# EAGLE board A33-OLinuXino_Rev_A (EAGLE 7.1.0)
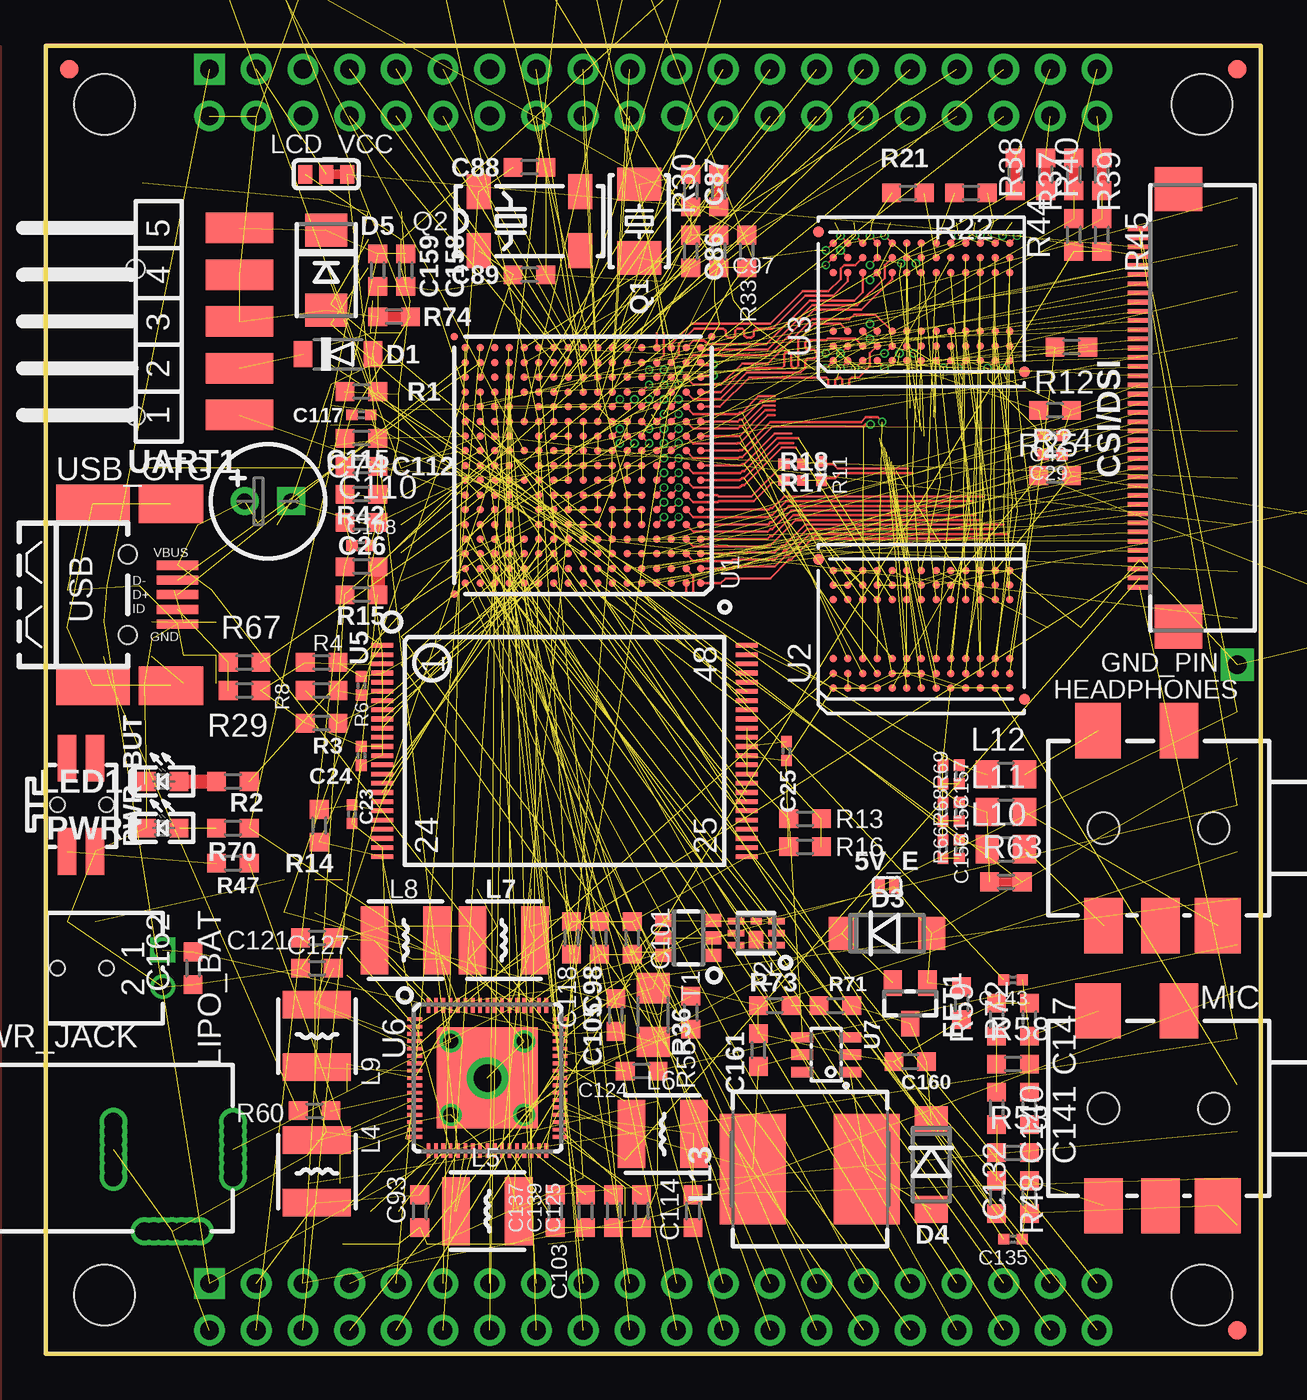
[diagram p5: board, top side]
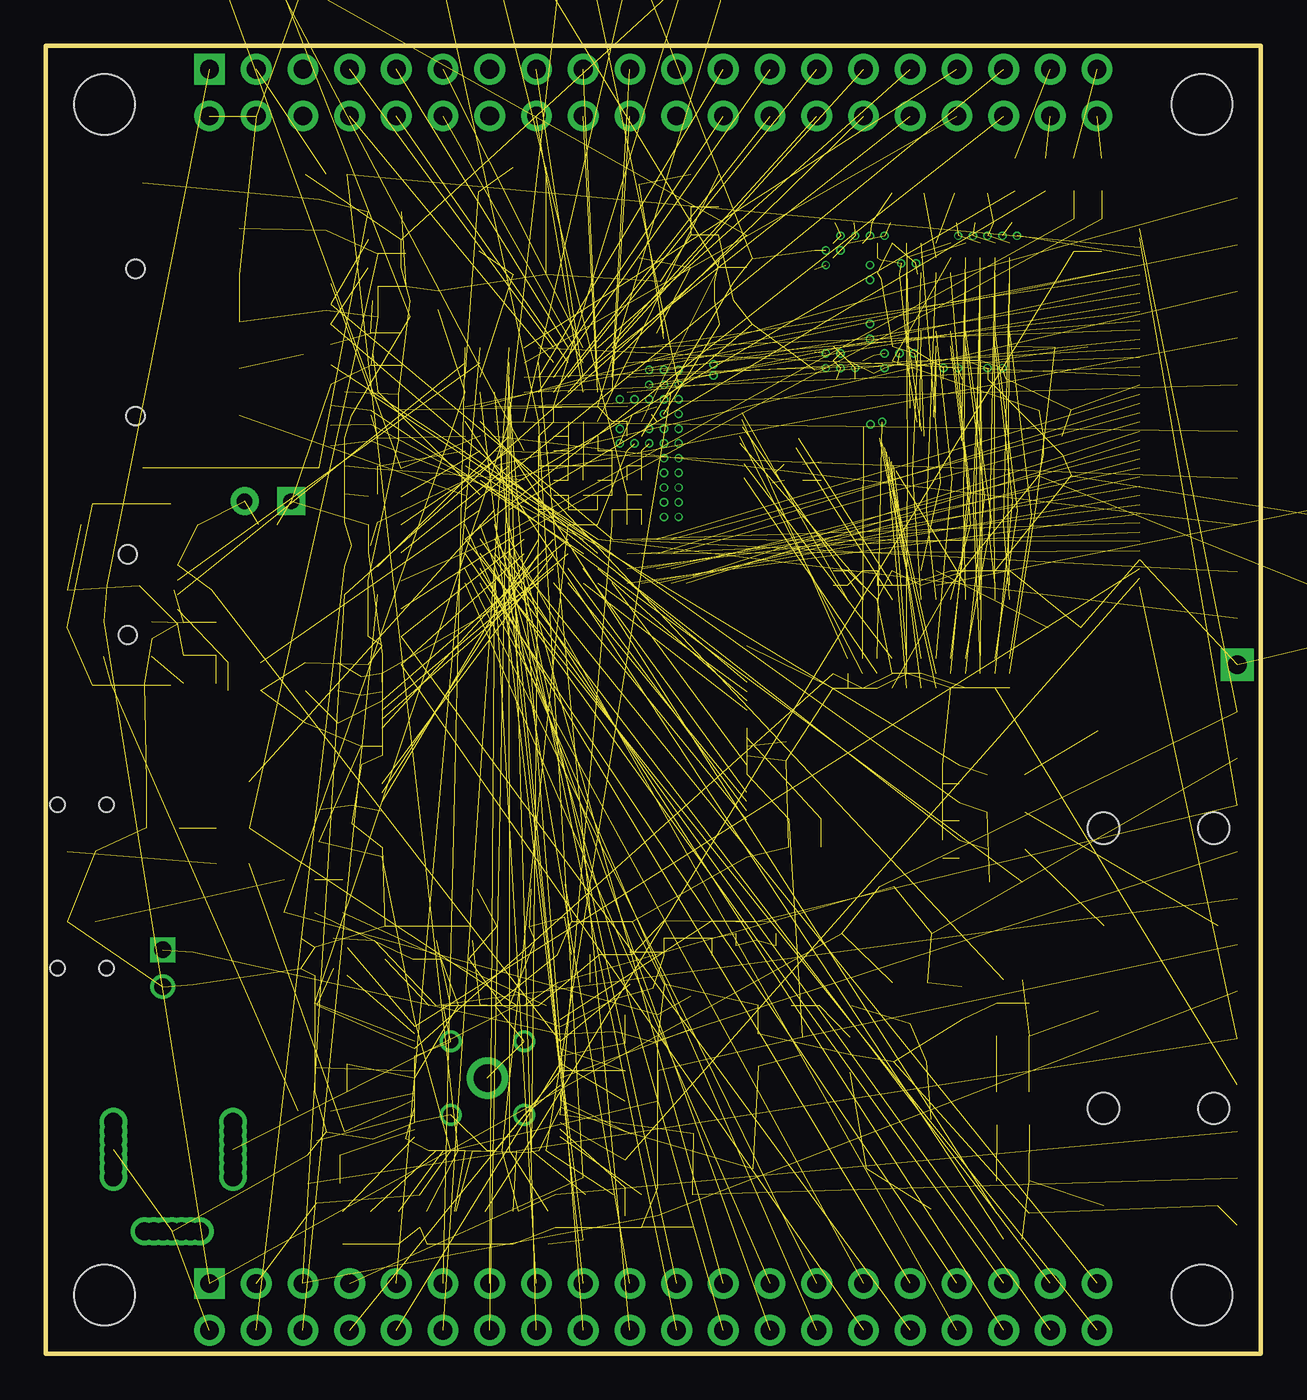
[diagram p6: board, inner layer GND]
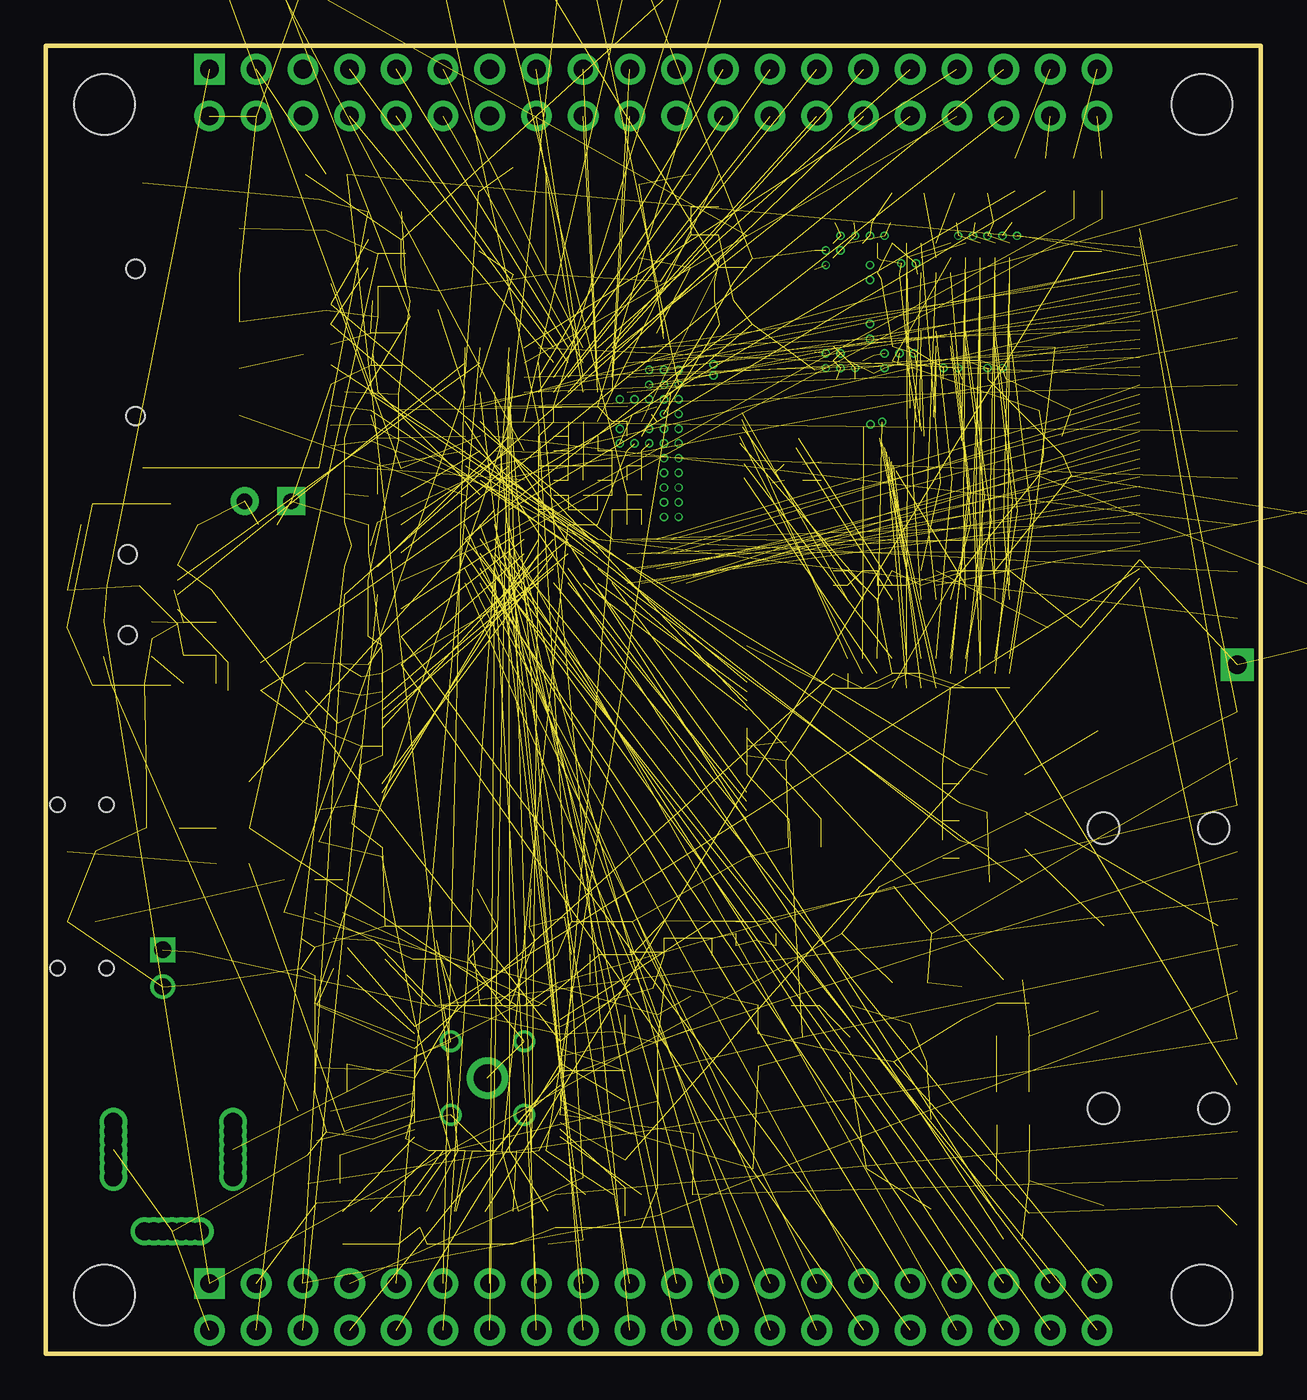
[diagram p7: board, inner layer Route3]
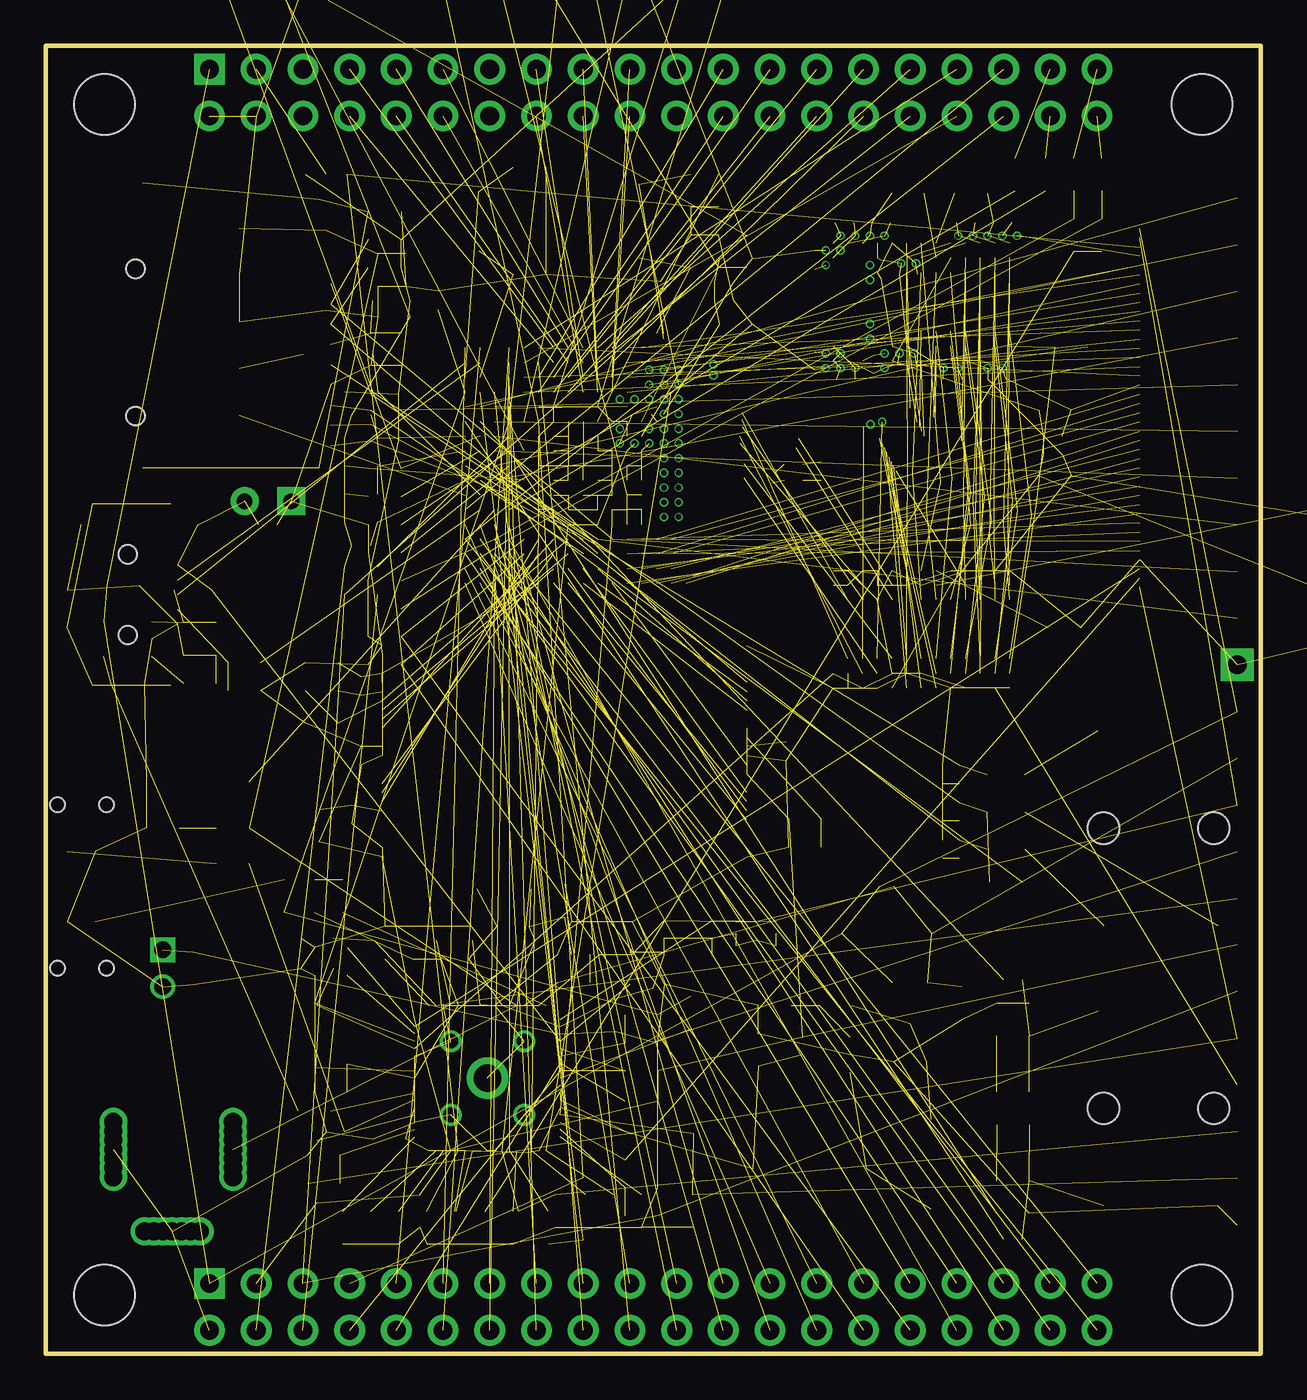
[diagram p8: board, inner layer Route14]
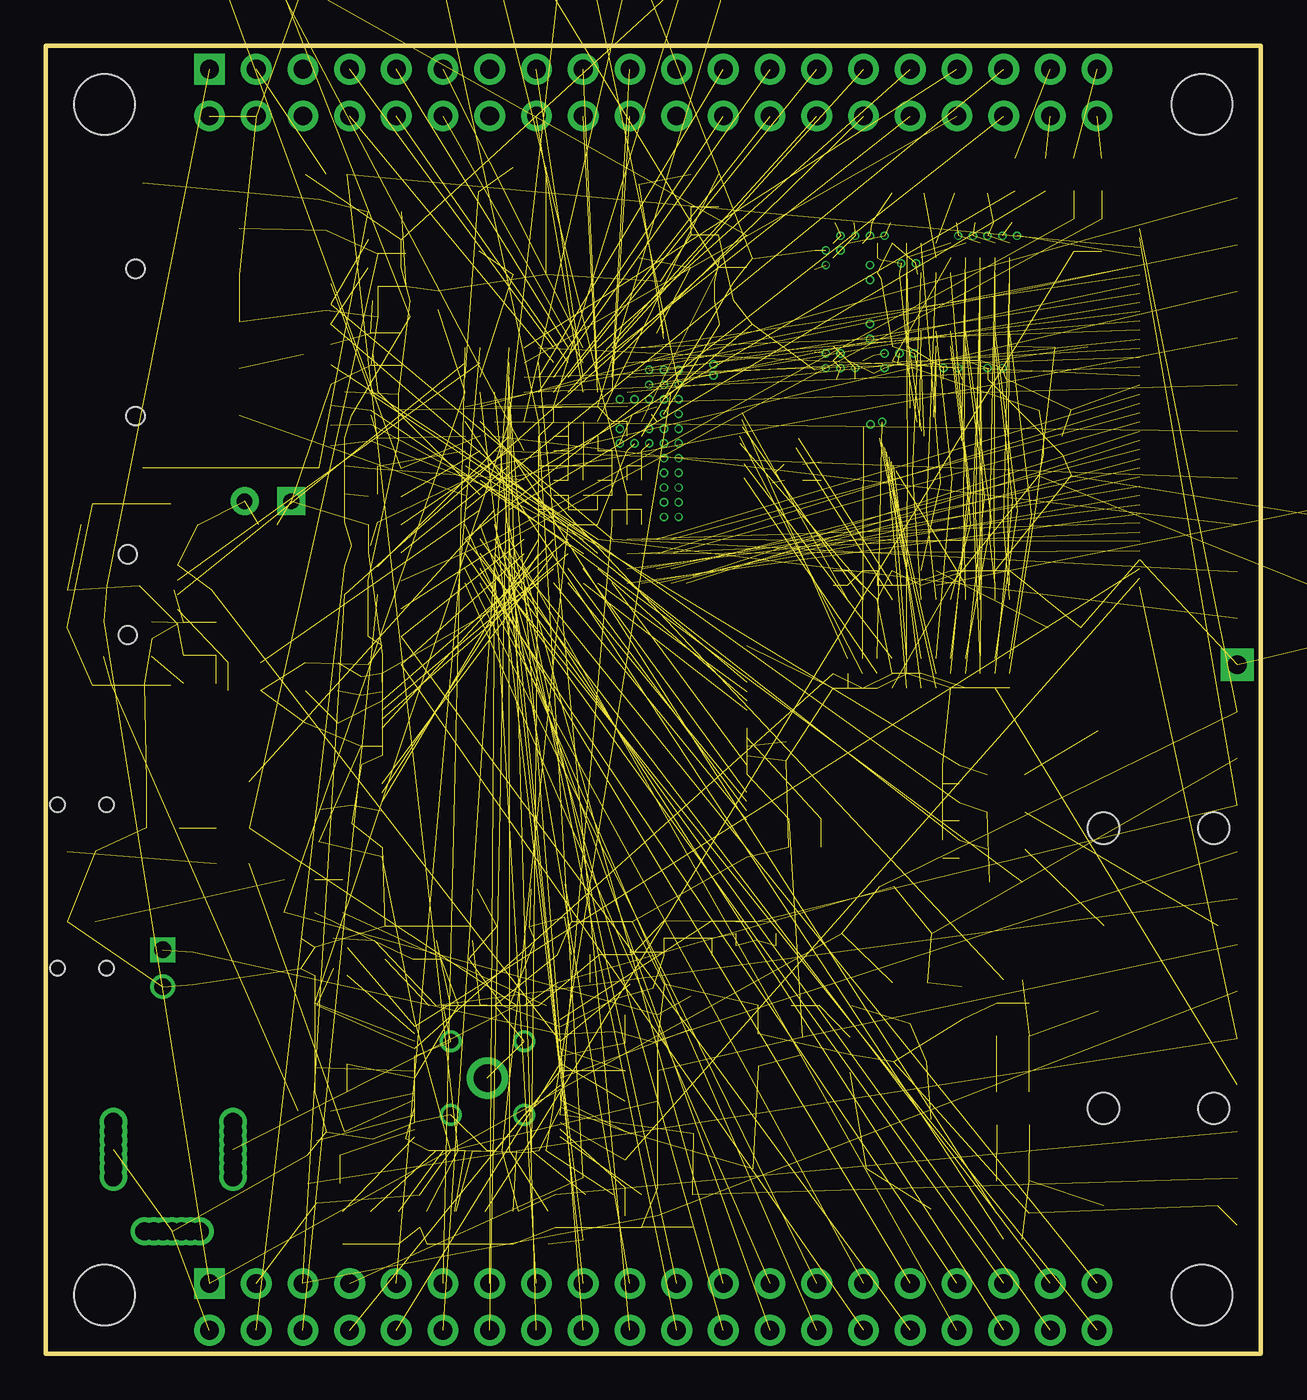
[diagram p9: board, inner layer PWR]
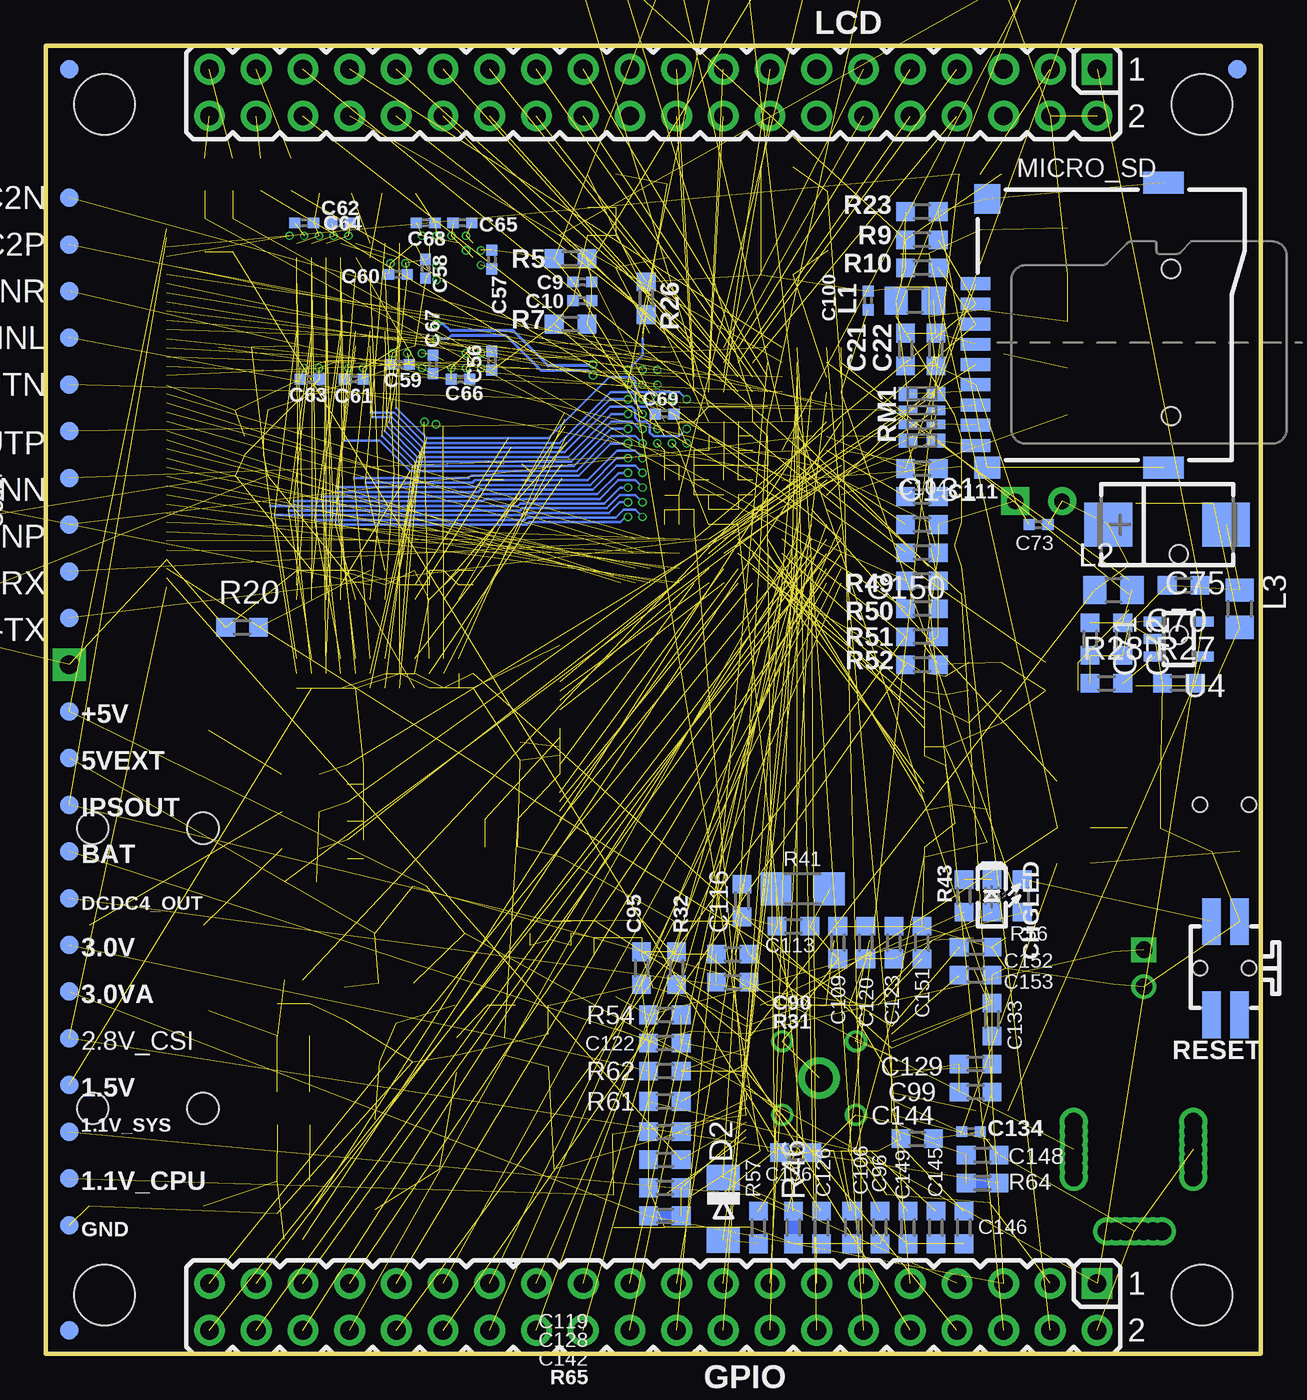
[diagram p10: board, bottom side, seen from below]

Size 66.04 x 71.12 mm. Coordinates in mm from the lower left corner, seen from the top.
Outline: 0,71.12 0,0 66.04,0 66.04,71.12 0,71.12
Copper layers (1+2*3+14*15+16): Top 0.035mm / dielectric 0.127mm / GND 0.035mm / dielectric 0.5mm / Route3 0.035mm / dielectric 0.2mm / Route14 0.035mm / dielectric 0.5mm / PWR 0.035mm / dielectric 0.127mm / Bottom 0.035mm
Design rules "default": minimum track width 4mil, minimum drill 0.2mm, track to track 5mil, track to pad 5mil, pad to pad 5mil, via to via 5mil, smd to smd 1mil, copper to edge 10mil, drill to drill 8mil, minimum pad ring 8mil, minimum via ring 3mil, stop-mask expansion 4mil, vias tented up to drill 28mil, thermal gap 20mil
Holes 3.3 mm at 3.17,67.94 62.87,67.94 3.17,3.17 62.87,3.17
tRestrict: area 0,64.8 to 6.3,71.1; area 59.7,64.8 to 66,71.1; area 0,0 to 6.3,6.3; area 59.7,0 to 66,6.3; 7 lines
bRestrict: area 0,64.8 to 6.3,71.1; area 59.7,64.8 to 66,71.1; area 0,0 to 6.3,6.3; area 59.7,0 to 66,6.3; 1 lines

## Footprints (pad centres in the part's own frame; a part is rotated, then mirrored left to right if it is on the bottom)
TESTPAD_40-ROUND = smd 1.016 x 1.016: 1 0,0
SJ_1_SMALLER = smd 0.508 x 0.762: 1 -0.381,0; 2 0.381,0
C0603_DWS = smd 1.016 x 1.016: 1 -0.889,0; 2 0.889,0
C0402_TI = smd 0.61 x 0.584: 1 -0.508,0; 2 0.508,0
E2,5-6,3 = drill 0.864 pad 1.524 round: + -1.27,0 | drill 0.864 pad 1.524 square: - 1.27,0
CT7343 = smd 2.6 x 2.4: + 3.2,0; - -3.2,0
LED-0603 = smd 1.016 x 1.016: A 0.889,0; C -0.889,0
FPV-WZA21-40-LF = smd 0.25 x 1.3: 1 -9.75,-2.75; 2 -9.25,-2.75; 3 -8.75,-2.75; 4 -8.25,-2.75; 5 -7.75,-2.75; 6 -7.25,-2.75; 7 -6.75,-2.75; 8 -6.25,-2.75; 9 -5.75,-2.75; 10 -5.25,-2.75; 11 -4.75,-2.75; 12 -4.25,-2.75; 13 -3.75,-2.75; 14 -3.25,-2.75; 15 -2.75,-2.75; 16 -2.25,-2.75; 17 -1.75,-2.75; 18 -1.25,-2.75; 19 -0.75,-2.75; 20 -0.25,-2.75; 21 0.25,-2.75; 22 0.75,-2.75; 23 1.25,-2.75; 24 1.75,-2.75; 25 2.25,-2.75; 26 2.75,-2.75; 27 3.25,-2.75; 28 3.75,-2.75; 29 4.25,-2.75; 30 4.75,-2.75; 31 5.25,-2.75; 32 5.75,-2.75; 33 6.25,-2.75; 34 6.75,-2.75; 35 7.25,-2.75; 36 7.75,-2.75; 37 8.25,-2.75; 38 8.75,-2.75; 39 9.25,-2.75; 40 9.75,-2.75 | smd 2.4 x 2.6: P1 -11.9,-0.65; P2 11.9,-0.65
SOD-123 = smd 1 x 1.4: A 1.9,0; C -1.9,0
MINI-MELF = smd 1.4 x 1.8: A 1.7,0; C -1.7,0
MLL-41 = smd 1.45 x 1.8: A 2.445,0; K -2.445,0
DO214AA = smd 1.778 x 2.286: A 2.177,0; C -2.177,0
SOT23 = smd 1.4 x 1: 1 1.1,-0.95; 2 1.1,0.95; 3 -1.1,0
TEST_PAD40/70/SQUARE = drill 1.016 pad 1.778 square: P$1 0,0
HN2X20-MALE = drill 1.016 pad 1.676 square: 1 -24.13,-1.27 | drill 1.016 pad 1.676 round: 2 -24.13,1.27; 3 -21.59,-1.27; 4 -21.59,1.27; 5 -19.05,-1.27; 6 -19.05,1.27; 7 -16.51,-1.27; 8 -16.51,1.27; 9 -13.97,-1.27; 10 -13.97,1.27; 11 -11.43,-1.27; 12 -11.43,1.27; 13 -8.89,-1.27; 14 -8.89,1.27; 15 -6.35,-1.27; 16 -6.35,1.27; 17 -3.81,-1.27; 18 -3.81,1.27; 19 -1.27,-1.27; 20 -1.27,1.27; 21 1.27,-1.27; 22 1.27,1.27; 23 3.81,-1.27; 24 3.81,1.27; 25 6.35,-1.27; 26 6.35,1.27; 27 8.89,-1.27; 28 8.89,1.27; 29 11.43,-1.27; 30 11.43,1.27; 31 13.97,-1.27; 32 13.97,1.27; 33 16.51,-1.27; 34 16.51,1.27; 35 19.05,-1.27; 36 19.05,1.27; 37 21.59,-1.27; 38 21.59,1.27; 39 24.13,-1.27; 40 24.13,1.27
SCJ325P00XG0B02G = smd 2.5 x 3: 1 6.3,-5.3; 2 -0.2,5.3 | smd 2.1 x 3: 3 6,5.3; 4 2.9,5.3; 5 1.9,-5.3 | hole 1.7: 0,0; 6,0
L0805_5MIL_DWS = smd 1.27 x 1.524: 1 -1.016,0; 2 1.016,0
SWPA4018S = smd 1.5 x 3.7: 1 -1.7,0; 2 1.7,0
8X8MM_3131 = smd 3.6 x 6: 1 -3.1,0; 2 3.1,0
SJ_2_SMALL_23_TIED = smd 0.762 x 1.016: 1 -1.143,0; 2 0,0; 3 1.143,0
DW02R = drill 0.9 square: 1 -1,0 | drill 0.9 round: 2 1,0
TFC-WPAPR-08 = smd 1.6 x 0.7: 1 -7.375,2.25; 2 -7.375,1.15; 3 -7.375,0.05; 4 -7.375,-1.05; 5 -7.375,-2.15; 6 -7.375,-3.25; 7 -7.375,-4.35; 8 -7.375,-5.45; 9 -7.375,-6.55 | smd 1.4 x 1.2: 10 -6.75,-7.75 | smd 1.4 x 1.6: 11 -6.75,6.85 | smd 2.2 x 1.2: 12 2.85,-7.75; 13 2.85,7.75 | hole 1: 3.25,-4.95; 3.25,3.05
SW_TAKT3X4 = smd 2.54 x 1.016: 1_1 -2.54,0.762; 1_2 2.54,0.762; 2_1 -2.54,-0.762; 2_2 2.54,-0.762 | hole 0.8: 0,-1.397; 0,1.27
PWR_JACK_UNI_MILLING = drill 1 round: + 0,4.75; +1 0,5.25; +2 0,5.75; +3 0,6.25; +4 0,4.25; +5 0,3.75; +6 0,3.25; - -6.5,4.75; -1 -6.5,5.25; -2 -6.5,5.75; -3 -6.5,4.25; -4 -6.5,3.75; -5 -6.5,6.25; -6 -6.5,3.25; -- -3.3,0.3; --1 -3.8,0.3; --2 -4.3,0.3; --3 -4.8,0.3; --4 -2.8,0.3; --5 -2.3,0.3; --6 -1.8,0.3
HCX-4S = smd 1.8 x 2.4: 1 -2,0; 2 2,0
MC-306 = smd 1.3 x 1.9: 1 -2.75,-1.6; 2 2.75,-1.6; 3 2.75,1.6; 4 -2.75,1.6
R0603_5MIL_DWS = smd 1.016 x 1.016: 1 -0.889,0; 2 0.889,0
R0402_TI = smd 0.61 x 0.584: 1 -0.508,0; 2 0.508,0
0603_0R = smd 1.016 x 1.016: 1 -0.889,0; 2 0.889,0
R1206_5MIL_WS = smd 1.651 x 1.778: 1 -1.46,0; 2 1.46,0
R_MATRIX_4 = smd 0.762 x 1.016: 1.1 -1.27,-0.762; 1.2 -1.27,0.762; 4.1 1.27,-0.762; 4.2 1.27,0.762 | smd 0.508 x 1.016: 2.1 -0.381,-0.762; 2.2 -0.381,0.762; 3.1 0.381,-0.762; 3.2 0.381,0.762
TSOT26 = smd 1 x 0.7: 1 1.3,-0.95; 2 1.3,0; 3 1.3,0.95; 4 -1.3,0.95; 5 -1.3,0; 6 -1.3,-0.95
DFN2*2-6L = smd 0.9 x 0.35: 1 1.1,-0.65; 2 1.1,0; 3 1.1,0.65; 4 -1.1,0.65; 5 -1.1,0; 6 -1.1,-0.65 | smd 0.8 x 0.95: 7 0,-0.35 | smd 0.6 x 0.35: 8 0,0.65
TFBGA282 = smd 0.4 x 0.4: A1 -6.4,-6.4; A2 -6.4,-5.6; A3 -6.4,-4.8; A4 -6.4,-4; A5 -6.4,-3.2; A6 -6.4,-2.4; A7 -6.4,-1.6; A8 -6.4,-0.8; A9 -6.4,0; A10 -6.4,0.8; A11 -6.4,1.6; A12 -6.4,2.4; A13 -6.4,3.2; A14 -6.4,4; A15 -6.4,4.8; A16 -6.4,5.6; A17 -6.4,6.4; B1 -5.6,-6.4; B2 -5.6,-5.6; B3 -5.6,-4.8; B4 -5.6,-4; B5 -5.6,-3.2; B6 -5.6,-2.4; B7 -5.6,-1.6; B8 -5.6,-0.8; B9 -5.6,0; B10 -5.6,0.8; B11 -5.6,1.6; B13 -5.6,3.2; B14 -5.6,4; B15 -5.6,4.8; B16 -5.6,5.6; B17 -5.6,6.4; C1 -4.8,-6.4; C2 -4.8,-5.6; C3 -4.8,-4.8; C4 -4.8,-4; C5 -4.8,-3.2; C6 -4.8,-2.4; C7 -4.8,-1.6; C8 -4.8,-0.8; C9 -4.8,0; C10 -4.8,0.8; C11 -4.8,1.6; C12 -4.8,2.4; C13 -4.8,3.2; C14 -4.8,4; C15 -4.8,4.8; C16 -4.8,5.6; C17 -4.8,6.4; D1 -4,-6.4; D2 -4,-5.6; D3 -4,-4.8; D4 -4,-4; D5 -4,-3.2; D6 -4,-2.4; D7 -4,-1.6; D8 -4,-0.8; D9 -4,0; D10 -4,0.8; D11 -4,1.6; D12 -4,2.4; D13 -4,3.2; D14 -4,4; D15 -4,4.8; D16 -4,5.6; D17 -4,6.4; E1 -3.2,-6.4; E2 -3.2,-5.6; E3 -3.2,-4.8; E4 -3.2,-4; E5 -3.2,-3.2; E6 -3.2,-2.4; E7 -3.2,-1.6; E8 -3.2,-0.8; E9 -3.2,0; E10 -3.2,0.8; E11 -3.2,1.6; E12 -3.2,2.4; E14 -3.2,4; E15 -3.2,4.8; E16 -3.2,5.6; E17 -3.2,6.4; F1 -2.4,-6.4; F2 -2.4,-5.6; F3 -2.4,-4.8; F4 -2.4,-4; F5 -2.4,-3.2; F6 -2.4,-2.4; F7 -2.4,-1.6; F8 -2.4,-0.8; F9 -2.4,0; F10 -2.4,0.8; F11 -2.4,1.6; F12 -2.4,2.4; F14 -2.4,4; F15 -2.4,4.8; F16 -2.4,5.6; F17 -2.4,6.4; FID1 7,-7; FID2 7,7; FID3 -7,7; G1 -1.6,-6.4; G2 -1.6,-5.6; G3 -1.6,-4.8; G4 -1.6,-4; G5 -1.6,-3.2; G6 -1.6,-2.4; G7 -1.6,-1.6; G8 -1.6,-0.8; G9 -1.6,0; G10 -1.6,0.8; G11 -1.6,1.6; G12 -1.6,2.4; G14 -1.6,4; G15 -1.6,4.8; G16 -1.6,5.6; G17 -1.6,6.4; H1 -0.8,-6.4; H2 -0.8,-5.6; H3 -0.8,-4.8; H4 -0.8,-4; H5 -0.8,-3.2; H6 -0.8,-2.4; H7 -0.8,-1.6; H8 -0.8,-0.8; H9 -0.8,0; H10 -0.8,0.8; H11 -0.8,1.6; H12 -0.8,2.4; H13 -0.8,3.2; H14 -0.8,4; H15 -0.8,4.8; H16 -0.8,5.6; H17 -0.8,6.4; J1 0,-6.4; J2 0,-5.6; J3 0,-4.8; J4 0,-4; J5 0,-3.2; J6 0,-2.4; J7 0,-1.6; J8 0,-0.8; J9 0,0; J10 0,0.8; J11 0,1.6; J12 0,2.4; J14 0,4; J15 0,4.8; J16 0,5.6; J17 0,6.4; K1 0.8,-6.4; K2 0.8,-5.6; K3 0.8,-4.8; K4 0.8,-4; K5 0.8,-3.2; K6 0.8,-2.4; K7 0.8,-1.6; K8 0.8,-0.8; K9 0.8,0; K10 0.8,0.8; K11 0.8,1.6; K12 0.8,2.4; K13 0.8,3.2; K14 0.8,4; K15 0.8,4.8; K16 0.8,5.6; K17 0.8,6.4; L1 1.6,-6.4; L2 1.6,-5.6; L3 1.6,-4.8; L4 1.6,-4; L5 1.6,-3.2; L6 1.6,-2.4; L7 1.6,-1.6; L8 1.6,-0.8; L9 1.6,0; L10 1.6,0.8; L11 1.6,1.6; L12 1.6,2.4; L14 1.6,4; L15 1.6,4.8; L16 1.6,5.6; L17 1.6,6.4; M1 2.4,-6.4; M2 2.4,-5.6; M3 2.4,-4.8; M4 2.4,-4; M5 2.4,-3.2; M6 2.4,-2.4; M7 2.4,-1.6; M8 2.4,-0.8; M9 2.4,0; M10 2.4,0.8; M11 2.4,1.6; M12 2.4,2.4; M13 2.4,3.2; M14 2.4,4; M15 2.4,4.8; M16 2.4,5.6; M17 2.4,6.4; N1 3.2,-6.4; N2 3.2,-5.6; N3 3.2,-4.8; N4 3.2,-4; N5 3.2,-3.2; N6 3.2,-2.4; N7 3.2,-1.6; N8 3.2,-0.8; N9 3.2,0; N10 3.2,0.8; N11 3.2,1.6; N12 3.2,2.4; N14 3.2,4; N15 3.2,4.8; N16 3.2,5.6; N17 3.2,6.4; P1 4,-6.4; P2 4,-5.6; P3 4,-4.8; P4 4,-4; P5 4,-3.2; P6 4,-2.4; P7 4,-1.6; P8 4,-0.8; P9 4,0; P10 4,0.8; P11 4,1.6; P12 4,2.4; P13 4,3.2; P14 4,4; P15 4,4.8; P16 4,5.6; P17 4,6.4; R1 4.8,-6.4; R2 4.8,-5.6; R3 4.8,-4.8; R4 4.8,-4; R5 4.8,-3.2; R6 4.8,-2.4; R7 4.8,-1.6; R8 4.8,-0.8; R9 4.8,0; R10 4.8,0.8; R11 4.8,1.6; R12 4.8,2.4; R13 4.8,3.2; R14 4.8,4; R15 4.8,4.8; R16 4.8,5.6; R17 4.8,6.4; T1 5.6,-6.4; T2 5.6,-5.6; T3 5.6,-4.8; T4 5.6,-4; T5 5.6,-3.2; T6 5.6,-2.4; T7 5.6,-1.6; T8 5.6,-0.8; T9 5.6,0; T10 5.6,0.8; T11 5.6,1.6; T12 5.6,2.4; T13 5.6,3.2; T14 5.6,4; T15 5.6,4.8; T16 5.6,5.6; T17 5.6,6.4; U1 6.4,-6.4; U2 6.4,-5.6; U3 6.4,-4.8; U4 6.4,-4; U5 6.4,-3.2; U6 6.4,-2.4; U7 6.4,-1.6; U8 6.4,-0.8; U9 6.4,0; U10 6.4,0.8; U11 6.4,1.6; U12 6.4,2.4; U13 6.4,3.2; U14 6.4,4; U15 6.4,4.8; U16 6.4,5.6; U17 6.4,6.4
FBGA78 = smd 0.4 x 0.4: A1 -4.8,-3.2; A2 -4.8,-2.4; A3 -4.8,-1.6; A7 -4.8,1.6; A8 -4.8,2.4; A9 -4.8,3.2; B1 -4,-3.2; B2 -4,-2.4; B3 -4,-1.6; B7 -4,1.6; B8 -4,2.4; B9 -4,3.2; C1 -3.2,-3.2; C2 -3.2,-2.4; C3 -3.2,-1.6; C7 -3.2,1.6; C8 -3.2,2.4; C9 -3.2,3.2; D1 -2.4,-3.2; D2 -2.4,-2.4; D3 -2.4,-1.6; D7 -2.4,1.6; D8 -2.4,2.4; D9 -2.4,3.2; E1 -1.6,-3.2; E2 -1.6,-2.4; E3 -1.6,-1.6; E7 -1.6,1.6; E8 -1.6,2.4; E9 -1.6,3.2; F1 -0.8,-3.2; F2 -0.8,-2.4; F3 -0.8,-1.6; F7 -0.8,1.6; F8 -0.8,2.4; F9 -0.8,3.2; G1 0,-3.2; G2 0,-2.4; G3 0,-1.6; G7 0,1.6; G8 0,2.4; G9 0,3.2; H1 0.8,-3.2; H2 0.8,-2.4; H3 0.8,-1.6; H7 0.8,1.6; H8 0.8,2.4; H9 0.8,3.2; J1 1.6,-3.2; J2 1.6,-2.4; J3 1.6,-1.6; J7 1.6,1.6; J8 1.6,2.4; J9 1.6,3.2; K1 2.4,-3.2; K2 2.4,-2.4; K3 2.4,-1.6; K7 2.4,1.6; K8 2.4,2.4; K9 2.4,3.2; L1 3.2,-3.2; L2 3.2,-2.4; L3 3.2,-1.6; L7 3.2,1.6; L8 3.2,2.4; L9 3.2,3.2; M1 4,-3.2; M2 4,-2.4; M3 4,-1.6; M7 4,1.6; M8 4,2.4; M9 4,3.2; N1 4.8,-3.2; N2 4.8,-2.4; N3 4.8,-1.6; N7 4.8,1.6; N8 4.8,2.4; N9 4.8,3.2 | smd 0.6 x 0.6: FID1 5.6,-3.8; FID2 -5.6,3.8
SOT23-5 = smd 1.2 x 0.55: 1 1.3,-0.95; 2 1.3,0; 3 1.3,0.95; 4 -1.3,0.95; 5 -1.3,-0.95
TSOP48 = smd 1.2 x 0.25: 1 -9.9,5.75; 2 -9.9,5.25; 3 -9.9,4.75; 4 -9.9,4.25; 5 -9.9,3.75; 6 -9.9,3.25; 7 -9.9,2.75; 8 -9.9,2.25; 9 -9.9,1.75; 10 -9.9,1.25; 11 -9.9,0.75; 12 -9.9,0.25; 13 -9.9,-0.25; 14 -9.9,-0.75; 15 -9.9,-1.25; 16 -9.9,-1.75; 17 -9.9,-2.25; 18 -9.9,-2.75; 19 -9.9,-3.25; 20 -9.9,-3.75; 21 -9.9,-4.25; 22 -9.9,-4.75; 23 -9.9,-5.25; 24 -9.9,-5.75; 25 9.9,-5.75; 26 9.9,-5.25; 27 9.9,-4.75; 28 9.9,-4.25; 29 9.9,-3.75; 30 9.9,-3.25; 31 9.9,-2.75; 32 9.9,-2.25; 33 9.9,-1.75; 34 9.9,-1.25; 35 9.9,-0.75; 36 9.9,-0.25; 37 9.9,0.25; 38 9.9,0.75; 39 9.9,1.25; 40 9.9,1.75; 41 9.9,2.25; 42 9.9,2.75; 43 9.9,3.25; 44 9.9,3.75; 45 9.9,4.25; 46 9.9,4.75; 47 9.9,5.25; 48 9.9,5.75
QFN68-8X8-04 = smd 0.2 x 0.8: 1 -3.2,-3.95; 2 -2.8,-3.95; 3 -2.4,-3.95; 4 -2,-3.95; 5 -1.6,-3.95; 6 -1.2,-3.95; 7 -0.8,-3.95; 8 -0.4,-3.95; 9 0,-3.95; 10 0.4,-3.95; 11 0.8,-3.95; 12 1.2,-3.95; 13 1.6,-3.95; 14 2,-3.95; 15 2.4,-3.95; 16 2.8,-3.95; 17 3.2,-3.95; 35 3.2,3.95; 36 2.8,3.95; 37 2.4,3.95; 38 2,3.95; 39 1.6,3.95; 40 1.2,3.95; 41 0.8,3.95; 42 0.4,3.95; 43 0,3.95; 44 -0.4,3.95; 45 -0.8,3.95; 46 -1.2,3.95; 47 -1.6,3.95; 48 -2,3.95; 49 -2.4,3.95; 50 -2.8,3.95; 51 -3.2,3.95 | smd 0.8 x 0.2: 18 3.95,-3.2; 19 3.95,-2.8; 20 3.95,-2.4; 21 3.95,-2; 22 3.95,-1.6; 23 3.95,-1.2; 24 3.95,-0.8; 25 3.95,-0.4; 26 3.95,0; 27 3.95,0.4; 28 3.95,0.8; 29 3.95,1.2; 30 3.95,1.6; 31 3.95,2; 32 3.95,2.4; 33 3.95,2.8; 34 3.95,3.2; 52 -3.95,3.2; 53 -3.95,2.8; 54 -3.95,2.4; 55 -3.95,2; 56 -3.95,1.6; 57 -3.95,1.2; 58 -3.95,0.8; 59 -3.95,0.4; 60 -3.95,0; 61 -3.95,-0.4; 62 -3.95,-0.8; 63 -3.95,-1.2; 64 -3.95,-1.6; 65 -3.95,-2; 66 -3.95,-2.4; 67 -3.95,-2.8; 68 -3.95,-3.2 | smd 5.49 x 5.49: GND 0,0 | drill 1.5 round: GND1 0,0 | drill 0.8 round: GND2 -2,-2; GND3 -2,2; GND4 2,2; GND5 2,-2
SOT23-6 = smd 1.2 x 0.55: 1 1.3,-0.95; 2 1.3,0; 3 1.3,0.95; 4 -1.3,0.95; 5 -1.3,0; 6 -1.3,-0.95
FIDUCIAL-1X3 = smd 1 x 1: 1 0,0
HR1X5-SMD = smd 1.651 x 3.683: 1 -5.08,-0.991; 2 -2.54,-0.991; 3 0,-0.991; 4 2.54,-0.991; 5 5.08,-0.991
USB_MINI_9PIN = smd 2.25 x 0.5: D+ 2.706,0; D- 2.706,0.8; GND 2.706,-1.6; ID 2.706,-0.8; VBUS 2.706,1.6 | smd 4 x 2.1: GND1 -1.9,4.95; GND3 -1.9,-4.95 | smd 3.5 x 2.1: GND2 2.35,4.95; GND4 2.35,-4.95 | hole 1: 0,2.2; 0,-2.2

## Placement (x,y rotation side)
1.1V_CPU  TESTPADTESTPAD_40-ROUND  [TESTPAD_40-ROUND]  64.77,9.53 0 bottom
1.1V_SYS  TESTPADTESTPAD_40-ROUND  [TESTPAD_40-ROUND]  64.77,12.06 270 bottom
1.5V  TESTPADTESTPAD_40-ROUND  [TESTPAD_40-ROUND]  64.77,14.61 90 bottom
2.8V_CSI  TESTPADTESTPAD_40-ROUND  [TESTPAD_40-ROUND]  64.77,17.14 0 bottom
3.0V  TESTPADTESTPAD_40-ROUND  [TESTPAD_40-ROUND]  64.77,22.23 270 bottom
3.0VA  TESTPADTESTPAD_40-ROUND  [TESTPAD_40-ROUND]  64.77,19.68 0 bottom
5V_E  Open  [SJ_1_SMALLER]  45.72,25.4 180 top
5VEXT  TESTPADTESTPAD_40-ROUND  [TESTPAD_40-ROUND]  64.77,32.38 270 bottom
+5V  TESTPADTESTPAD_40-ROUND  [TESTPAD_40-ROUND]  64.77,34.92 180 bottom
BAT  TESTPADTESTPAD_40-ROUND  [TESTPAD_40-ROUND]  64.77,27.3 90 bottom
C1  22uF/6.3V  [C0603_DWS]  29.37,81.79 270 bottom  (outside the outline)
C2  1uF  [C0603_DWS]  24.64,87.51 90 bottom  (outside the outline)
C3  100nF  [C0402_TI]  27.57,82.66 180 bottom  (outside the outline)
C4  100nF  [C0402_TI]  27.57,83.56 180 bottom  (outside the outline)
C5  100nF  [C0402_TI]  27.57,84.46 180 bottom  (outside the outline)
C6  100nF  [C0402_TI]  27.57,85.36 180 bottom  (outside the outline)
C7  100nF  [C0402_TI]  26.64,87.51 90 bottom  (outside the outline)
C8  100nF  [C0402_TI]  25.64,87.51 90 bottom  (outside the outline)
C9  100nF  [C0402_TI]  36.88,58.28 0 bottom
C10  100nF  [C0402_TI]  36.88,57.27 0 bottom
C11  22uF/6.3V  [C0603_DWS]  6.73,83.95 90 bottom  (outside the outline)
C12  1uF  [C0603_DWS]  5.21,83.95 90 bottom  (outside the outline)
C13  100nF  [C0402_TI]  19.59,81.36 180 bottom  (outside the outline)
C14  100nF  [C0402_TI]  19.59,80.16 180 bottom  (outside the outline)
C15  100nF  [C0402_TI]  21.72,80.66 0 bottom  (outside the outline)
C16  100nF  [C0402_TI]  23.67,80.66 0 bottom  (outside the outline)
C17  100nF  [C0402_TI]  23.67,81.96 0 bottom  (outside the outline)
C18  100nF  [C0402_TI]  20.45,83.69 270 bottom  (outside the outline)
C19  100nF  [C0402_TI]  22.48,83.69 270 bottom  (outside the outline)
C20  100nF  [C0402_TI]  21.46,83.69 270 bottom  (outside the outline)
C21  22uF/6.3V  [C0603_DWS]  19.3,54.61 90 bottom
C22  22uF/6.3V  [C0603_DWS]  17.65,54.61 90 bottom
C23  NA(100nF)  [C0402_TI]  16.64,29.34 90 top
C24  NA(100nF)  [C0402_TI]  17.14,32.51 90 top
C25  NA(100nF)  [C0402_TI]  40.26,32.77 90 top
C26  1nF  [C0603_DWS]  17.14,42.8 180 top
C27  100nF  [C0402_TI]  73.55,39.36 90 bottom  (outside the outline)
C28  100nF  [C0402_TI]  76.6,55.8 0 bottom  (outside the outline)
C29  100nF  [C0402_TI]  54.74,48.9 180 top
C30  22uF/6.3V  [C0603_DWS]  13.46,83.95 270 bottom  (outside the outline)
C31  1uF  [C0603_DWS]  11.94,83.95 270 bottom  (outside the outline)
C32  100nF  [C0402_TI]  27.89,86.86 270 bottom  (outside the outline)
C33  100nF  [C0402_TI]  16.64,76.71 90 top  (outside the outline)
C34  100nF  [C0402_TI]  15.62,76.71 90 top  (outside the outline)
C35  100nF  [C0402_TI]  14.61,76.71 90 top  (outside the outline)
C36  100nF  [C0402_TI]  14.73,83.31 90 bottom  (outside the outline)
C37  100nF  [C0402_TI]  24.97,84.61 0 bottom  (outside the outline)
C38  100nF  [C0402_TI]  22.37,85.26 180 bottom  (outside the outline)
C39  100nF  [C0402_TI]  24.97,85.86 0 bottom  (outside the outline)
C40  100nF  [C0402_TI]  22.37,86.53 180 bottom  (outside the outline)
C41  100nF  [C0402_TI]  23.3,87.96 270 bottom  (outside the outline)
C42  100nF  [C0402_TI]  54.74,49.91 180 top
C43  100nF  [C0402_TI]  71.14,39.23 90 bottom  (outside the outline)
C44  100nF  [C0402_TI]  72.1,46.1 180 bottom  (outside the outline)
C45  100nF  [C0402_TI]  75.3,44.8 270 bottom  (outside the outline)
C46  100nF  [C0402_TI]  77.87,39.36 90 bottom  (outside the outline)
C47  100nF  [C0402_TI]  77.2,45.4 180 bottom  (outside the outline)
C48  100nF  [C0402_TI]  80.28,38.6 90 bottom  (outside the outline)
C49  100nF  [C0402_TI]  81.2,47.5 0 bottom  (outside the outline)
C50  100nF  [C0402_TI]  81.93,38.6 90 bottom  (outside the outline)
C51  100nF  [C0402_TI]  83.2,47.5 0 bottom  (outside the outline)
C52  100nF  [C0402_TI]  69.99,39.23 90 bottom  (outside the outline)
C53  100nF  [C0402_TI]  69.6,46 270 bottom  (outside the outline)
C54  100nF  [C0402_TI]  72.28,38.6 90 bottom  (outside the outline)
C55  100nF  [C0402_TI]  71.3,47.4 180 bottom  (outside the outline)
C56  100nF  [C0402_TI]  41.8,54 90 bottom
C57  100nF  [C0402_TI]  41.8,59.5 90 bottom
C58  100nF  [C0402_TI]  45.4,59 270 bottom
C59  100nF  [C0402_TI]  46.8,53.8 180 bottom
C60  100nF  [C0402_TI]  46.9,58.7 180 bottom
C61  100nF  [C0402_TI]  49.3,53 180 bottom
C62  100nF  [C0402_TI]  50,61.5 180 bottom
C63  100nF  [C0402_TI]  51.7,53 0 bottom
C64  100nF  [C0402_TI]  52,61.5 180 bottom
C65  100nF  [C0402_TI]  43.4,61.5 0 bottom
C66  100nF  [C0402_TI]  43.5,53 180 bottom
C67  100nF  [C0402_TI]  45,53.8 90 bottom
C68  100nF  [C0402_TI]  45.4,61.5 180 bottom
C69  100nF  [C0402_TI]  32.4,51.1 180 bottom
C70  22uF/6.3V  [C0603_DWS]  4.19,41.78 180 bottom
C71  22uF/6.3V  [C0603_DWS]  9.27,38.86 270 bottom
C72  22uF/6.3V  [C0603_DWS]  7.49,38.86 270 bottom
C73  100nF  [C0402_TI]  12.06,45.09 180 bottom
C74  100uF/16V/LOWESR/105C/6.3x11mm_RM2.5  [E2,5-6,3]  12.06,46.35 0 top
C75  NA(220uF/10V/tant)  [CT7343]  5.08,45.09 180 bottom
C76  22uF/6.3V  [C0603_DWS]  25.53,76.71 270 top  (outside the outline)
C77  100nF  [C0402_TI]  24.13,76.71 90 top  (outside the outline)
C78  100nF  [C0402_TI]  23.11,76.71 90 top  (outside the outline)
C79  100nF  [C0402_TI]  22.1,76.71 90 top  (outside the outline)
C80  100nF  [C0402_TI]  18.92,76.71 90 top  (outside the outline)
C81  100nF  [C0402_TI]  21.08,76.71 90 top  (outside the outline)
C82  100nF  [C0402_TI]  17.78,76.71 90 top  (outside the outline)
C83  100nF  [C0402_TI]  20.07,76.71 90 top  (outside the outline)
C84  100nF  [C0402_TI]  29.21,76.71 90 top  (outside the outline)
C85  100nF  [C0402_TI]  28.19,76.71 90 top  (outside the outline)
C86  33pF  [C0603_DWS]  35.05,59.94 270 top
C87  33pF  [C0603_DWS]  35.05,63.25 90 top
C88  10pF  [C0603_DWS]  26.29,64.52 180 top
C89  10pF  [C0603_DWS]  26.29,58.67 180 top
C90  10uF/6.3V  [C0603_DWS]  28.7,21.72 180 bottom
C91  10uF/6.3V  [C0603_DWS]  32.26,76.71 270 top  (outside the outline)
C92  100nF  [C0402_TI]  19.39,85.06 90 bottom  (outside the outline)
C93  10uF/6.3V  [C0603_DWS]  20.32,7.75 90 top
C94  100nF  [C0402_TI]  20.3,86.69 180 bottom  (outside the outline)
C95  10uF/6.3V  [C0603_DWS]  33.66,20.95 90 bottom
C96  10uF/6.3V  [C0603_DWS]  20.7,6.86 90 bottom
C97  10uF/6.3V  [C0603_DWS]  36.58,59.94 270 top
C98  10uF/6.3V  [C0603_DWS]  30.1,22.61 270 top
C99  10uF/6.3V  [C0603_DWS]  15.49,14.22 180 bottom
C100  NA(100nF)  [C0402_TI]  21.34,57.28 270 bottom
C101  10uF/6.3V  [C0603_DWS]  31.88,22.61 270 top
C102  100nF  [C0402_TI]  9.02,76.83 270 top  (outside the outline)
C103  10uF/6.3V  [C0603_DWS]  27.69,7.75 90 top
C104  10uF/6.3V  [C0603_DWS]  18.41,48.13 0 bottom
C105  1uF  [C0603_DWS]  30.99,18.41 270 top
C106  10uF/6.3V  [C0603_DWS]  22.23,6.86 90 bottom
C107  100nF  [C0402_TI]  11.56,76.96 270 top  (outside the outline)
C108  100nF  [C0402_TI]  17.14,43.94 0 top
C109  10uF/6.3V  [C0603_DWS]  22.99,22.35 270 bottom
C110  10uF/6.3V  [C0603_DWS]  17.14,45.21 0 top
C111  1uF  [C0603_DWS]  18.41,46.61 180 bottom
C112  10uF/6.3V  [C0603_DWS]  17.14,48.26 0 top
C113  1uF  [C0603_DWS]  25.4,23.24 0 bottom
C114  10uF/6.3V  [C0603_DWS]  35.18,7.75 90 top
C115  10uF/6.3V  [C0603_DWS]  17.14,49.78 0 top
C116  10uF/6.3V  [C0603_DWS]  28.19,24.64 270 bottom
C117  100nF  [C0402_TI]  17.14,51.05 0 top
C118  10uF/6.3V  [C0603_DWS]  28.57,22.61 270 top
C119  10uF/6.3V  [C0603_DWS]  32.38,12.06 0 bottom
C120  10uF/6.3V  [C0603_DWS]  21.46,22.35 270 bottom
C121  NA(10uF/6.3V)  [C0603_DWS]  14.73,22.61 0 top
C122  10uF/6.3V  [C0603_DWS]  32.38,16.89 0 bottom
C123  NA(10uF/6.3V)  [C0603_DWS]  19.94,22.35 270 bottom
C124  1uF  [C0603_DWS]  32.38,15.37 180 top
C125  1uF  [C0603_DWS]  32.38,7.75 90 top
C126  10uF/6.3V  [C0603_DWS]  23.88,6.86 90 bottom
C127  10uF/6.3V  [C0603_DWS]  14.73,20.95 0 top
C128  10uF/6.3V  [C0603_DWS]  32.38,10.54 0 bottom
C129  10uF/6.3V  [C0603_DWS]  15.49,15.75 180 bottom
C130  100nF  [C0402_TI]  35.18,76.71 270 top  (outside the outline)
C131  1uF  [C0603_DWS]  18.41,45.09 0 bottom
C132  33pF  [C0603_DWS]  53.47,8.51 90 top
C133  10uF/6.3V  [C0603_DWS]  14.61,18.16 90 bottom
C134  100nF  [C0402_TI]  15.75,12.06 180 bottom
C135  100nF  [C0402_TI]  52.58,6.22 180 top
C136  10uF/6.3V  [C0603_DWS]  25.27,10.92 180 bottom
C137  10uF/6.3V  [C0603_DWS]  29.34,7.75 90 top
C138  100nF  [C0402_TI]  36.32,76.71 270 top  (outside the outline)
C139  10uF/6.3V  [C0603_DWS]  30.86,7.75 90 top
C140  10uF/6.3V  [C0603_DWS]  51.69,13.34 270 top
C141  100pF  [C0603_DWS]  53.47,13.34 270 top
C142  10uF/6.3V  [C0603_DWS]  32.38,9.02 0 bottom
C143  100nF  [C0402_TI]  52.58,20.32 180 top
C144  10uF/6.3V  [C0603_DWS]  18.67,11.68 180 bottom
C145  10uF/6.3V  [C0603_DWS]  17.65,6.86 90 bottom
C146  10uF/6.3V  [C0603_DWS]  16.13,6.86 90 bottom
C147  33pF  [C0603_DWS]  53.47,18.16 270 top
C148  10uF/6.3V  [C0603_DWS]  15.11,10.79 180 bottom
C149  10uF/6.3V  [C0603_DWS]  19.18,6.86 90 bottom
C150  10uF/6.3V  [C0603_DWS]  18.41,43.56 180 bottom
C151  NA(10uF/6.3V)  [C0603_DWS]  18.41,22.35 270 bottom
C152  10uF/6.3V  [C0603_DWS]  15.49,22.1 180 bottom
C153  NA(10uF/6.3V)  [C0603_DWS]  15.49,20.57 180 bottom
C154  100nF  [C0402_TI]  37.47,76.71 270 top  (outside the outline)
C155  100nF  [C0402_TI]  48.77,27.43 270 top
C156  100nF  [C0402_TI]  48.77,29.46 270 top
C157  100nF  [C0402_TI]  48.77,31.5 270 top
C158  22uF/6.3V  [C0603_DWS]  19.56,58.93 270 top
C159  22uF/6.3V  [C0603_DWS]  18.03,58.93 270 top
C160  22uF/6.3V  [C0603_DWS]  46.99,15.88 180 top
C161  22uF/6.3V  [C0603_DWS]  38.73,16.51 270 top
C162  22uF/6.3V  [C0603_DWS]  8,20.95 90 top
CHGLED  LED/YELLOW/0603  [LED-0603]  14.61,24.89 270 bottom
CSI/DSI  FPV-WZA21-40-LF  [FPV-WZA21-40-LF]  62.23,51.44 270 top
D1  1N5819(S4SOD-123)  [SOD-123]  15.88,54.36 0 top
D2  1N4148/SOD80C  [MINI-MELF]  29.21,7.87 270 bottom
D3  1N5822/SS34/SMA  [MLL-41]  45.72,22.86 0 top
D4  1N5822/SS34/SMA  [MLL-41]  48.13,10.29 270 top
D5  SMBJ6.0A  [DO214AA]  15.24,58.93 270 top
DCDC4_OUT  TESTPADTESTPAD_40-ROUND  [TESTPAD_40-ROUND]  64.77,24.77 270 bottom
FET1  IRLML6402  [SOT23]  46.99,19.05 90 top
GND  TESTPADTESTPAD_40-ROUND  [TESTPAD_40-ROUND]  64.77,6.99 270 bottom
GND_PIN  TESTPAD3  [TEST_PAD40/70/SQUARE]  64.77,37.47 90 top
GPIO  HN2X20  [HN2X20-MALE]  33.02,2.54 180 bottom
HEADPHONES  SCJ325P00XG0B02G  [SCJ325P00XG0B02G]  63.5,28.57 180 top
IPSOUT  TESTPADTESTPAD_40-ROUND  [TESTPAD_40-ROUND]  64.77,29.84 0 bottom
L1  FB0805/600R/2A  [L0805_5MIL_DWS]  18.8,57.28 0 bottom
L2  FB0805/600R/2A  [L0805_5MIL_DWS]  8,41.53 0 bottom
L3  FB0805/600R/2A  [L0805_5MIL_DWS]  1.14,40.51 270 bottom
L4  SWPA4018S1R5NT(1.5uH/3A/DCR<0.1R)  [SWPA4018S]  14.73,9.91 90 top
L5  SWPA4018S1R5NT(1.5uH/3A/DCR<0.1R)  [SWPA4018S]  24,7.75 180 top
L6  SWPA4018S1R5NT(1.5uH/3A/DCR<0.1R)  [SWPA4018S]  33.53,11.94 180 top
L7  SWPA4018S1R5NT(1.5uH/3A/DCR<0.1R)  [SWPA4018S]  24.89,22.48 0 top
L8  NA(SWPA4018S1R5NT(1.5uH/3A/DCR<0.1R))  [SWPA4018S]  19.56,22.48 0 top
L9  SWPA4018S1R5NT(1.5uH/3A/DCR<0.1R)  [SWPA4018S]  14.73,17.27 270 top
L10  FB0805/600R/2A  [L0805_5MIL_DWS]  52.2,27.43 0 top
L11  FB0805/600R/2A  [L0805_5MIL_DWS]  52.2,29.46 0 top
L12  FB0805/600R/2A  [L0805_5MIL_DWS]  52.2,31.5 0 top
L13  2.2uH/3A/YS75/7x8  [8X8MM_3131]  41.53,10.03 0 top
LCD  HN2X20  [HN2X20-MALE]  33.02,68.58 180 bottom
LCD_VCC  open/close  [SJ_2_SMALL_23_TIED]  15.24,64.14 0 top
LED1  LED/GREEN/0603  [LED-0603]  6.35,31.11 0 top
LINEINL  TESTPADTESTPAD_40-ROUND  [TESTPAD_40-ROUND]  64.77,55.24 0 bottom
LINEINR  TESTPADTESTPAD_40-ROUND  [TESTPAD_40-ROUND]  64.77,57.78 0 bottom
LIPO_BAT  DW02R  [DW02R]  6.35,20.95 270 top
MIC  SCJ325P00XG0B02G  [SCJ325P00XG0B02G]  63.5,13.34 180 top
MIC2N  TESTPADTESTPAD_40-ROUND  [TESTPAD_40-ROUND]  64.77,62.87 0 bottom
MIC2P  TESTPADTESTPAD_40-ROUND  [TESTPAD_40-ROUND]  64.77,60.33 0 bottom
MICRO_SD  TFC-WPAPR-08  [TFC-WPAPR-08]  8.12,55.94 0 bottom
PHINN  TESTPADTESTPAD_40-ROUND  [TESTPAD_40-ROUND]  64.77,47.62 0 bottom
PHINP  TESTPADTESTPAD_40-ROUND  [TESTPAD_40-ROUND]  64.77,45.09 0 bottom
PHOUTN  TESTPADTESTPAD_40-ROUND  [TESTPAD_40-ROUND]  64.77,52.7 0 bottom
PHOUTP  TESTPADTESTPAD_40-ROUND  [TESTPAD_40-ROUND]  64.77,50.16 0 bottom
PWR  LED/RED/0603  [LED-0603]  6.35,28.57 0 top
PWR_BUT  SIDE_WTCM-TR(3X4)  [SW_TAKT3X4]  1.91,29.84 90 top
PWR_JACK  PWRJ-2mm(YDJ-1136)  [PWR_JACK_UNI_MILLING]  10.16,6.35 0 top
Q1  4SB24.000F20E15/5x3.2mm/20ppm/20pF  [HCX-4S]  32.26,61.59 270 top
Q2  MC-306_32.768KHZ/SMD_8038/6pF  [MC-306]  26.29,61.59 0 top
R1  10k  [R0603_5MIL_DWS]  17.14,52.32 180 top
R2  2k/1%  [R0603_5MIL_DWS]  10.16,31.11 180 top
R3  NA(10k)  [R0603_5MIL_DWS]  14.99,34.29 0 top
R4  NA(10k)  [R0603_5MIL_DWS]  14.99,37.59 0 top
R5  2k/1%  [R0603_5MIL_DWS]  37.51,59.55 180 bottom
R6  NA(22R)  [R0402_TI]  17.14,36.32 270 top
R7  2k/1%  [R0603_5MIL_DWS]  37.51,55.99 0 bottom
R8  NA  [R0603_5MIL_DWS]  14.99,36.07 180 top
R9  100k  [R0603_5MIL_DWS]  18.41,60.58 180 bottom
R10  10k  [R0603_5MIL_DWS]  18.41,59.05 180 bottom
R11  NA  [R0402_TI]  42.16,48.01 270 top
R12  2k/1%  [R0603_5MIL_DWS]  55.75,54.74 180 top
R13  NA  [R0603_5MIL_DWS]  41.27,29.08 0 top
R14  NA(10k)  [R0603_5MIL_DWS]  14.86,28.7 90 top
R15  100k  [R0603_5MIL_DWS]  17.14,41.27 0 top
R16  NA  [R0603_5MIL_DWS]  41.27,27.56 180 top
R17  22R  [R0402_TI]  40.64,48.39 180 top
R18  22R  [R0402_TI]  40.64,47.5 180 top
R19  243R/1%  [R0603_5MIL_DWS]  78.6,47.7 0 bottom  (outside the outline)
R20  NA(243R/1%)  [R0603_5MIL_DWS]  55.37,39.5 0 bottom
R21  243R/1%  [R0603_5MIL_DWS]  46.86,63.12 0 top
R22  NA(243R/1%)  [R0603_5MIL_DWS]  50.29,63.12 180 top
R23  10k  [R0603_5MIL_DWS]  18.41,62.1 180 bottom
R24  2k/1%  [R0603_5MIL_DWS]  54.86,47.75 0 top
R25  2k/1%  [R0603_5MIL_DWS]  54.86,51.31 180 top
R26  243R/1%  [R0603_5MIL_DWS]  33.4,57.4 270 bottom
R27  100k  [R0603_5MIL_DWS]  4.45,36.45 0 bottom
R28  6.81k/1%  [R0603_5MIL_DWS]  8.38,36.45 0 bottom
R29  10k  [R0603_5MIL_DWS]  10.79,36.07 180 top
R30  0R(Board_Mounted)  [0603_0R]  36.58,63.25 90 top
R31  1R  [R0603_5MIL_DWS]  28.7,20.19 0 bottom
R32  1R  [R0603_5MIL_DWS]  31.75,20.95 270 bottom
R33  1R  [R0603_5MIL_DWS]  38.1,59.94 90 top
R34  1R  [R0603_5MIL_DWS]  10.29,76.96 270 top  (outside the outline)
R35  1R  [R0603_5MIL_DWS]  7.62,77.09 270 top  (outside the outline)
R36  0.01R/1%  [R1206_5MIL_WS]  33.02,18.41 270 top
R37  0R(Board_Mounted)  [0603_0R]  52.7,64.14 270 top
R38  0R(Board_Mounted)  [0603_0R]  54.36,64.14 90 top
R39  0R(Board_Mounted)  [0603_0R]  55.88,64.14 270 top
R40  0R(Board_Mounted)  [0603_0R]  57.4,64.14 90 top
R41  0.01R/1%  [R1206_5MIL_WS]  24.89,25.27 0 bottom
R42  200k/1%  [R0603_5MIL_DWS]  17.14,46.74 180 top
R43  2k/1%  [R0603_5MIL_DWS]  16.13,24.89 270 bottom
R44  NA(2.2k)  [R0603_5MIL_DWS]  55.88,60.83 90 top
R45  NA(2.2k)  [R0603_5MIL_DWS]  57.4,60.83 270 top
R46  0R(Board_Mounted)  [0603_0R]  25.4,6.86 270 bottom
R47  2k/1%  [R0603_5MIL_DWS]  10.16,26.67 0 top
R48  1k  [R0603_5MIL_DWS]  51.69,8.51 270 top
R49  2.2k  [R0603_5MIL_DWS]  18.41,42.04 0 bottom
R50  2.2k  [R0603_5MIL_DWS]  18.41,40.51 0 bottom
R51  2.2k  [R0603_5MIL_DWS]  18.41,38.99 0 bottom
R52  2.2k  [R0603_5MIL_DWS]  18.41,37.47 0 bottom
R53  1.5k  [R0603_5MIL_DWS]  52.58,10.92 0 top
R54  NA(10k)  [R0603_5MIL_DWS]  32.38,18.41 0 bottom
R55  1R  [R0603_5MIL_DWS]  35.05,18.54 270 top
R56  243R/1%  [R0603_5MIL_DWS]  12.95,24.89 270 bottom
R57  10k  [R0603_5MIL_DWS]  27.3,6.86 270 bottom
R58  1.5k  [R0603_5MIL_DWS]  52.58,15.75 0 top
R59  1k  [R0603_5MIL_DWS]  51.69,18.16 90 top
R60  243R/1%  [R0603_5MIL_DWS]  14.61,13.21 0 top
R61  NA  [R0603_5MIL_DWS]  32.38,13.72 0 bottom
R62  NA  [R0603_5MIL_DWS]  32.38,15.37 0 bottom
R63  0R(Board_Mounted)  [0603_0R]  52.2,25.65 0 top
R64  0R(Board_Mounted)  [0603_0R]  15.11,9.27 180 bottom
R65  0R(Board_Mounted)  [0603_0R]  32.38,7.49 0 bottom
R66  22R  [R0402_TI]  49.66,27.43 90 top
R67  243R/1%  [R0603_5MIL_DWS]  10.79,37.59 0 top
R68  22R  [R0402_TI]  49.66,29.46 90 top
R69  22R  [R0402_TI]  49.66,31.5 90 top
R70  2k/1%  [R0603_5MIL_DWS]  10.16,28.57 180 top
R71  8.25k/1%  [R0603_5MIL_DWS]  42.93,18.92 0 top
R72  100k  [R0603_5MIL_DWS]  49.78,19.05 270 top
R73  1.1k/1%  [R0603_5MIL_DWS]  39.62,18.92 180 top
R74  0R(Board_Mounted)  [0603_0R]  18.92,56.39 0 top
RESET  SIDE_WTCM-TR(3X4)  [SW_TAKT3X4]  1.91,20.95 270 bottom
RM1  RA1206_(4X0603)_4B8_100K  [R_MATRIX_4]  18.41,50.93 90 bottom
T1  NA(DMP2035UVT)  [TSOT26]  34.92,22.61 0 top
T2  WPM1481  [DFN2*2-6L]  38.61,22.86 0 top
U1  A33/TFBGA282  [TFBGA282]  29.2,48.3 90 top
U2  H5TQ2G83CFR-H9C  [FBGA78]  47.6,39.4 0 top
U3  H5TQ2G83CFR-H9C  [FBGA78]  47.6,57.2 0 top
U4  SY6280(SOT23-5)  [SOT23-5]  4.45,38.86 180 bottom
U5  NA(H27UBG8T2BTR-BC)  [TSOP48]  28.19,32.77 0 top
U6  AXP223  [QFN68-8X8-04]  24,14.99 270 top
U7  SY7208(SOT23-6)  [SOT23-6]  42.42,16.26 0 top
U8  FIDUCIAL  [FIDUCIAL-1X3]  1.27,69.85 90 top
U9  FIDUCIAL  [FIDUCIAL-1X3]  64.77,69.85 180 top
U10  FIDUCIAL  [FIDUCIAL-1X3]  64.77,69.85 0 bottom
U11  FIDUCIAL  [FIDUCIAL-1X3]  64.77,1.27 90 top
U12  FIDUCIAL  [FIDUCIAL-1X3]  64.77,1.27 180 bottom
U13  FIDUCIAL  [FIDUCIAL-1X3]  1.27,69.85 0 bottom
U$6  [OLIMEX1_V]  64.39,89.66 0 bottom  (outside the outline)
U$8  [OLIMEX1_V]  97.92,36.83 0 top  (outside the outline)
U$9  [PB]  90.81,23.5 0 top  (outside the outline)
U$10  [ESD_SYMBOL]  81.28,19.68 0 top  (outside the outline)
U$11  [RECYCLE_BIN1/8]  93.34,20.32 0 top  (outside the outline)
U$12  [ROHS]  81.92,10.16 0 top  (outside the outline)
UART0-RX  TESTPADTESTPAD_40-ROUND  [TESTPAD_40-ROUND]  64.77,42.55 180 bottom
UART0-TX  TESTPADTESTPAD_40-ROUND  [TESTPAD_40-ROUND]  64.77,40.01 180 bottom
UART1  H-WX-1X5-LF  [HR1X5-SMD]  9.53,56.13 90 top
USB_OTG  USB-OTG  [USB_MINI_9PIN]  4.45,41.27 0 top

## Tracks (layer width: path | path; a pad name or v marks a point on that pad's centre or on a via)
1.1V_CPUS  (3 unrouted)
1.8V_DVDD-CSI  (2 unrouted)
2.5V_ALDO2  (via drill 0.3)  (3 unrouted)
  Top 0.127: U1.P3 v34.4,52.7
2.8V_AVDD-CSI  (2 unrouted)
3.0V_ALDO1  (19 unrouted)
3.3V_CTP  (3 unrouted)
+5V  (8 unrouted)
+5V_OTG_PWR  (6 unrouted)
+15V  (13 unrouted)
+24V  (5 unrouted)
ALDO3  (2 unrouted)
AXP-NMI#  (2 unrouted)
AXP-RESET#  (4 unrouted)
AXP_PWRON  (2 unrouted)
CHGLED  (1 unrouted)
DCDC4_OUT  (3 unrouted)
DLDO1  (1 unrouted)
DLDO2  (1 unrouted)
DLDO3  (2 unrouted)
DLDO4  (1 unrouted)
DSI-CKN  (1 unrouted)
DSI-CKP  (1 unrouted)
DSI-DN0  (via drill 0.3)  (1 unrouted)
  Top 0.127: U1.R4 v33.6,53.5
DSI-DN1  (via drill 0.3)  (1 unrouted)
  Top 0.127: U1.R5 v32.8,53.5
DSI-DN2  (1 unrouted)
DSI-DN3  (1 unrouted)
DSI-DP0  (via drill 0.3)  (1 unrouted)
  Top 0.127: U1.P4 v33.6,52.7
DSI-DP1  (via drill 0.3)  (1 unrouted)
  Top 0.127: U1.P5 v32.8,52.7
DSI-DP2  (1 unrouted)
DSI-DP3  (1 unrouted)
ELDO1  (1 unrouted)
ELDO3  (1 unrouted)
GND  (via drill 0.3)  (270 unrouted)
  Top 0.127: U1.N4 v33.6,51.9 | U1.K7 v31.2,49.5 | U3.A1 v42.4,53.6 | U3.A8 v42.4,59.2 | U3.D8 v44.8,59.2 | U3.F2 v46.4,54.4 | U3.F8 v46.5,59.3 | U3.J1 v48.8,53.6 | U3.N1 v52,53.6 | U3.J9 v49.6,60.8 | U3.L9 v51.2,60.8 | U3.N9 v52.8,60.8 | U3.C9 v44,60.8 | U3.B1 v43.2,53.6 | U3.D1 v45.6,53.6 | U3.D9 v44.8,60.8 | U3.B2 v43.2,54.4 | U3.B8 v43.2,60
  pour Route3 (isolate 0.305, rank 4): -71.12,76.2 -71.12,-7.62 -7.62,-7.62 -7.62,76.2
  pour Top (isolate 0.305, rank 2): -76.2,-2.54 -2.54,-2.54 -2.54,71.12 -76.2,71.12
  pour Bottom (isolate 0.305, rank 3): -5.08,-5.08 -73.66,-5.08 -73.66,73.66 -5.08,73.66
  pour GND (isolate 0.305, rank 3): -10.16,78.74 -10.16,-10.16 -68.83,-10.16 -68.83,78.74
  pour Route14 (isolate 0.305, rank 5): -15.24,-15.24 -63.5,-15.24 -63.5,83.82 -15.24,83.82
GNDA  (13 unrouted)
HBIAS  (1 unrouted)
HPCOM  (3 unrouted)
HPCOMFB  (1 unrouted)
HPOUTL  (2 unrouted)
HPOUTR  (2 unrouted)
HPVCCIN  (2 unrouted)
IPSOUT  (29 unrouted)
LCD_CLK  (1 unrouted)
LCD_D2  (1 unrouted)
LCD_D3  (1 unrouted)
LCD_D4  (1 unrouted)
LCD_D5  (1 unrouted)
LCD_D6  (1 unrouted)
LCD_D7  (1 unrouted)
LCD_D10  (1 unrouted)
LCD_D11  (1 unrouted)
LCD_D12  (1 unrouted)
LCD_D13  (1 unrouted)
LCD_D14  (1 unrouted)
LCD_D15  (1 unrouted)
LCD_D18  (1 unrouted)
LCD_D19  (1 unrouted)
LCD_D20  (1 unrouted)
LCD_D21  (1 unrouted)
LCD_D22  (1 unrouted)
LCD_D23  (1 unrouted)
LCD_DE  (1 unrouted)
LCD_HSYNC  (1 unrouted)
LCD_VSYNC  (1 unrouted)
LINEINL  (1 unrouted)
LINEINR  (1 unrouted)
LRADC0  (2 unrouted)
  Top 0.762: C26.1 R15.2
MBIAS  (2 unrouted)
MIC1N  (1 unrouted)
MIC1P  (1 unrouted)
MIC2N  (1 unrouted)
MIC2P  (1 unrouted)
N0RBX  (2 unrouted)
N$1  (1 unrouted)
N$2  (via drill 0.3)  (1 unrouted)
  Top 0.127: U1.R3 v34.4,53.5
  Bottom 0.127: v34.4,53.5 33.6,54.3 33.6,55.2
N$3  (1 unrouted)
N$4  (1 unrouted)
N$5  (1 unrouted)
N$6  (4 unrouted)
N$7  (1 unrouted)
N$8  (1 unrouted)
  Top 0.127: U1.G1 36.48,46.7 36.58,46.61 38.35,46.61 39.62,47.88
N$9  (1 unrouted)
  Top 0.127: U1.G2 35.2,46.3 36.52,46.3 36.58,46.35 38.48,46.35 39.5,47.37
N$10  (1 unrouted)
N$11  (1 unrouted)
N$12  (3 unrouted)
N$13  (1 unrouted)
N$14  (1 unrouted)
N$15  (2 unrouted)
N$16  (1 unrouted)
N$17  (15 unrouted)
N$18  (2 unrouted)
N$19  (2 unrouted)
N$20  (1 unrouted)
N$21  (5 unrouted)
N$22  (1 unrouted)
N$23  (3 unrouted)
N$24  (1 unrouted)
N$25  (1 unrouted)
N$26  (1 unrouted)
N$27  (1 unrouted)
N$28  (1 unrouted)
N$29  (1 unrouted)
N$30  (2 unrouted)
N$31  (3 unrouted)
N$32  (2 unrouted)
N$33  (4 unrouted)
N$34  (1 unrouted)
N$35  (1 unrouted)
N$36  (1 unrouted)
N$37  (2 unrouted)
N$38  (1 unrouted)
N$39  (1 unrouted)
N$40  (1 unrouted)
N$41  (1 unrouted)
N$42  (1 unrouted)
N$43  (1 unrouted)
N$44  (1 unrouted)
N$45  (1 unrouted)
N$46  (4 unrouted)
N$47  (2 unrouted)
N$48  (2 unrouted)
N$49  (1 unrouted)
N$50  (9 unrouted)
N$58  (4 unrouted)
N$86  (2 unrouted)
N$116  (2 unrouted)
N$122  (2 unrouted)
N$123  (2 unrouted)
N$126  (2 unrouted)
N$129  (1 unrouted)
N$134  (1 unrouted)
N$135  (1 unrouted)
N$176  (2 unrouted)
N$231
  Top 0.762: LED1.A R2.2
NWP  (2 unrouted)
PB0/UART0-TX  (1 unrouted)
PB1/UART0-RX  (2 unrouted)
PB2/LCD_PWR  (1 unrouted)
PB7/LED  (1 unrouted)
PC0/N0WE  (1 unrouted)
PC1/N0ALE  (1 unrouted)
PC2/N0CLE  (1 unrouted)
PC3/N0CE1  (1 unrouted)
PC4/N0CE0  (1 unrouted)
PC5/N0RE  (1 unrouted)
PC6/N0RB0  (3 unrouted)
PC7/N0RB1  (4 unrouted)
PC8/N0DQ0  (1 unrouted)
PC9/N0DQ1  (1 unrouted)
PC10/N0DQ2  (1 unrouted)
PC11/N0DQ3  (1 unrouted)
PC12/N0DQ4  (1 unrouted)
PC13/N0DQ5  (1 unrouted)
PC14/N0DQ6  (1 unrouted)
PC15/N0DQ7  (1 unrouted)
PC16/N0DQS  (1 unrouted)
PE0/CSI-PCLK  (1 unrouted)
PE1/CSI-MCLK  (1 unrouted)
PE2/CSI-HSYNC  (1 unrouted)
PE3/CSI-VSYNC  (1 unrouted)
PE4/CSI-D0  (1 unrouted)
PE5/CSI-D1  (1 unrouted)
PE6/CSI-D2  (1 unrouted)
PE7/CSI-D3  (1 unrouted)
PE8/CSI-D4  (1 unrouted)
PE9/CSI-D5  (1 unrouted)
PE10/CSI-D6  (1 unrouted)
PE11/CSI-D7  (1 unrouted)
PE12/CSI-SCK  (1 unrouted)
  Top 0.127: U1.A2 34.8,41.4
PE13/CSI-SDA  (1 unrouted)
  Top 0.127: U1.B2 35.2,42.3 35.2,41.4
PE14/CSI-STBY-R  (1 unrouted)
PE15/CSI-RST-R  (1 unrouted)
PE16/CSI-STBY-F  (1 unrouted)
PE17/CSI-RST-F  (1 unrouted)
PG0  (1 unrouted)
PG1  (1 unrouted)
PG2  (1 unrouted)
PG3  (1 unrouted)
PG4  (1 unrouted)
PG5  (1 unrouted)
PG6  (1 unrouted)
PG7  (1 unrouted)
PG8  (1 unrouted)
PG9  (1 unrouted)
PG10  (1 unrouted)
PG11  (1 unrouted)
PG12  (1 unrouted)
PG13  (1 unrouted)
PH0/PWM0  (2 unrouted)
PH1/PWM1  (1 unrouted)
PH2/TWI0-SCK(TP)  (4 unrouted)
PH3/TWI0-SDA(TP)  (4 unrouted)
PH4/TWI1_SCK  (2 unrouted)
PH5/TWI1_SDA  (2 unrouted)
PH6  (1 unrouted)
PH7  (1 unrouted)
PH8  (1 unrouted)
PH9  (1 unrouted)
PHINN  (1 unrouted)
PHINP  (1 unrouted)
PHOUTN  (1 unrouted)
PHOUTP  (1 unrouted)
PL0/PMU-SCK  (3 unrouted)
PL1/PMU-SDA  (3 unrouted)
PL2  (1 unrouted)
PL3  (1 unrouted)
PL4  (1 unrouted)
PL5  (1 unrouted)
PL6/LCD_LR  (1 unrouted)
PL7/LCD_UD  (1 unrouted)
PL8/DSI-EN  (1 unrouted)
PL9/DSI-RST  (1 unrouted)
PL10/S-PWM  (1 unrouted)
PL11  (1 unrouted)
PWROK  (1 unrouted)
S0BA0  (via drill 0.3)  (2 unrouted)
  Top 0.127: U1.J3 v34.4,48.7
  Bottom 0.127: v34.4,48.7 34.99,48.7 36.45,47.24 42.55,47.24 42.67,47.12 50.16,47.12
S0BA1  (via drill 0.3)  (2 unrouted)
  Top 0.127: U1.K4 v33.6,49.5
  Bottom 0.127: v33.6,49.5 34,49.9 35.3,49.9 37.19,48.01 46.23,48.01 47.88,49.66 49.78,49.66
S0BA2  (via drill 0.3)  (2 unrouted)
  Top 0.127: U1.H4 v33.6,47.9
  Bottom 0.127: v33.6,47.9 34,48.3 35.01,48.3 36.32,46.99 42.42,46.99 42.55,46.86 50.29,46.86
S0CASN  (via drill 0.3)  (2 unrouted)
  Top 0.127: U1.M3 v34.4,51.1
  Bottom 0.127: v34.4,51.1 35.3,51.1 37.63,48.77 45.85,48.77 47.5,50.42
S0CKE0  (via drill 0.3)  (2 unrouted)
  Top 0.127: U1.J4 v33.6,48.7
  Bottom 0.127: v33.6,48.7 34,49.1 34.97,49.1 36.58,47.5 42.72,47.5 42.84,47.37 48.64,47.37
S0CKE1  (via drill 0.3)  (2 unrouted)
  Top 0.127: U1.N7 v31.2,51.9
  Bottom 0.127: v31.2,51.9 31.6,52.3 33.8,52.3 34,52.5 34,52.9 34.2,53.1 35.42,53.1 38.73,49.78 45.34,49.78 46.99,51.44
S0CLK  (3 unrouted)
  Top 0.127: R11.1 42.29,48.39 42.8,48.39 43.05,48.13 46.86,48.13
S0CLKN  (3 unrouted)
  Top 0.127: R11.2 42.29,47.62 42.93,47.62 43.18,47.88 47.12,47.88
S0DDR3_RST  (via drill 0.3)  (3 unrouted)
  Top 0.127: U1.G3 v34.4,47.1
  Bottom 0.127: v34.4,47.1 34.81,47.1 35.69,46.23 40.26,46.23 40.39,46.1 53.85,46.1
S0DQ0  (1 unrouted)
  Top 0.127: U1.M1 37.62,50.7 37.72,50.8 37.85,50.8 38.86,51.82 39.62,51.82
S0DQ1  (1 unrouted)
  Top 0.127: U1.M2 35.2,50.3 37.6,50.3 37.72,50.42 37.85,50.42 38.99,51.56 39.62,51.56
S0DQ2  (1 unrouted)
  Top 0.127: U1.L1 37.58,49.9 37.59,49.91 37.72,49.91 39.12,51.31 39.62,51.31
S0DQ3  (1 unrouted)
  Top 0.127: U1.L2 35.2,49.5 37.56,49.5 37.59,49.53 37.72,49.53 39.24,51.05 39.62,51.05
S0DQ4  (1 unrouted)
  Top 0.127: U1.J1 37.76,48.3 37.85,48.39 37.97,48.39 39.62,50.04 40.51,50.04
S0DQ5  (1 unrouted)
  Top 0.127: U1.J2 35.2,47.9 37.74,47.9 37.85,48.01 37.97,48.01 39.75,49.78 40.89,49.78
S0DQ6  (1 unrouted)
  Top 0.127: U1.H1 37.72,47.5 37.85,47.62 37.97,47.62 39.88,49.53 40.64,49.53
S0DQ7  (1 unrouted)
  Top 0.127: U1.H2 35.2,47.1 37.7,47.1 37.85,47.24 37.97,47.24 40.01,49.28 40.77,49.28
S0DQ8
  Top 0.127: U1.U3 34,54.9 35.11,56.01 39.37,56.01 41.15,57.78 42.55,57.78 43.2,58.44 43.2,59 43.4,59.2 44,59.2 U3.C8
S0DQ9
  Top 0.127: U3.E8 45.6,59.2 45.6,58.5 44.12,57.02 41.66,57.02 39.23,54.6 35.7,54.6 U1.U1
S0DQ10
  Top 0.127: U3.C7 44.4,57.73 43.94,57.28 41.53,57.28 39.15,54.9 36,54.9 35.8,55.1 35.2,55.1 U1.U2
S0DQ11
  Top 0.127: U1.T2 35.2,54.3 39.31,54.3 41.78,56.77 44.32,56.77 46,58.45 U3.E7
S0DQ12
  Top 0.127: U1.R2 35.2,52.7 36.7,52.7 37.85,53.85 39.24,53.85 41.66,56.26 43.69,56.26 43.94,56.52 45.09,56.52 U3.E3
S0DQ13
  Top 0.127: U1.P1 36.68,52.3 37.97,53.59 40.01,53.59 40.13,53.72 40.13,54.36 40.26,54.48 40.39,54.48 40.51,54.36 40.51,53.72 40.64,53.59 40.77,53.59 40.89,53.72 40.89,55.12 41.78,56.01 43.19,56.01 U3.B3
S0DQ14
  Top 0.127: U1.P2 35.2,51.9 36.66,51.9 38.1,53.34 41.02,53.34 41.27,53.59 41.27,53.98 41.4,54.1 41.78,54.1 41.91,54.23 41.91,54.48 41.78,54.61 41.4,54.61 41.27,54.74 41.27,54.99 41.4,55.12 42.42,55.12 42.5,55.2 44,55.2 U3.C2
S0DQ15
  Top 0.127: U1.N1 36.64,51.5 38.23,53.09 42.42,53.09 42.55,52.96 42.55,52.7 42.67,52.58 42.8,52.58 42.93,52.7 42.93,52.96 43.05,53.09 43.18,53.09 43.31,52.96 43.31,52.7 43.43,52.58 43.56,52.58 43.69,52.7 43.69,52.96 43.81,53.09 44.19,53.09 44.8,53.7 44.8,54.4 U3.D2
S0ODT0  (via drill 0.3)  (2 unrouted)
  Top 0.127: U1.L3 v34.4,50.3
  Bottom 0.127: v34.4,50.3 35.3,50.3 37.34,48.26 46.1,48.26 47.75,49.91
S0ODT1  (via drill 0.3)  (2 unrouted)
  Top 0.127: U1.L7 v31.2,50.3
  Bottom 0.127: v31.2,50.3 31.6,49.9 33,49.9 33.2,50.1 33.2,50.5 33.4,50.7 33.8,50.7 34,50.9 34,51.3 34.2,51.5 35.37,51.5 37.85,49.02 45.72,49.02 47.37,50.67
S0RASN  (via drill 0.3)  (2 unrouted)
  Top 0.127: U1.L4 v33.6,50.3
  Bottom 0.127: v33.6,50.3 33.8,50.3 34.2,50.7 35.3,50.7 37.49,48.51 45.97,48.51 47.62,50.16
S0SA0  (via drill 0.3)  (2 unrouted)
  Top 0.127: U1.E4 v33.6,45.5
  Bottom 0.127: v33.6,45.5 34,45.9 34.62,45.9 35.05,45.47 39.88,45.47 40.01,45.34 51.44,45.34
S0SA1  (2 unrouted)
  Top 0.127: U1.D1 39.22,44.3 39.37,44.45 39.5,44.45 40.64,45.59 50.55,45.59
S0SA2  (2 unrouted)
  Top 0.127: U1.F2 35.2,45.5 39.28,45.5 39.37,45.59 39.5,45.59 40.26,46.35 50.42,46.35
S0SA3  (via drill 0.3)  (2 unrouted)
  Top 0.127: U1.H3 v34.4,47.9
  Bottom 0.127: v34.4,47.9 34.9,47.9 36.07,46.74 42.29,46.74 42.42,46.61 51.05,46.61
S0SA4  (2 unrouted)
  Top 0.127: U1.D2 35.2,43.9 39.2,43.9 39.24,43.94 39.37,43.94 40.77,45.34 50.8,45.34
S0SA5  (2 unrouted)
  Top 0.127: U1.F1 39.3,45.9 39.37,45.97 39.5,45.97 40.13,46.61 50.93,46.61
S0SA6  (2 unrouted)
  Top 0.127: U1.A1 36.69,41.9 36.96,42.16 39.37,42.16 40.39,43.18 40.51,43.18 41.66,44.32 51.31,44.32
S0SA7  (via drill 0.3)  (2 unrouted)
  Top 0.127: U1.G4 v33.6,47.1
  Bottom 0.127: v33.6,47.1 34,47.5 34.92,47.5 35.94,46.48 42.16,46.48 42.29,46.35 52.58,46.35
S0SA8  (2 unrouted)
  Top 0.127: U1.B1 37.29,42.7 37.39,42.8 39.62,42.8 40.26,43.43 40.39,43.43 41.53,44.58 52.32,44.58
S0SA9  (via drill 0.3)  (2 unrouted)
  Top 0.127: U1.F4 v33.6,46.3
  Bottom 0.127: v33.6,46.3 34,46.7 34.83,46.7 35.56,45.97 40.13,45.97 40.26,45.85 52.83,45.85
S0SA10  (2 unrouted)
  Top 0.127: U1.E2 35.2,44.7 39.24,44.7 39.37,44.83 39.5,44.83 40.51,45.85 47.88,45.85
S0SA11  (2 unrouted)
  Top 0.127: U1.C2 35.2,43.1 37.26,43.1 37.34,43.18 39.62,43.18 40.13,43.69 40.26,43.69 41.4,44.83 51.56,44.83
S0SA12  (2 unrouted)
  Top 0.127: U1.E1 39.26,45.1 39.37,45.21 39.5,45.21 40.39,46.1 49.91,46.1
S0SA13  (via drill 0.3)  (2 unrouted)
  Top 0.127: U1.F3 v34.4,46.3
  Bottom 0.127: v34.4,46.3 34.85,46.3 35.43,45.72 40.01,45.72 40.13,45.59 53.59,45.59
S0SA14  (2 unrouted)
  Top 0.127: U1.C1 37.15,43.5 37.21,43.56 39.62,43.56 40.01,43.94 40.13,43.94 41.27,45.09 52.07,45.09
S0SA15  (via drill 0.3)  (2 unrouted)
  Top 0.127: U1.E3 v34.4,45.5
  Bottom 0.127: v34.4,45.5 34.53,45.5 34.82,45.21 39.75,45.21 39.88,45.09 50.29,45.09
S0SCS0  (via drill 0.3)  (2 unrouted)
  Top 0.127: U1.N3 v34.4,51.9
  Bottom 0.127: v34.4,51.9 35.35,51.9 37.97,49.28 45.59,49.28 47.24,50.93 48.26,50.93
S0SCS1  (via drill 0.3)  (2 unrouted)
  Top 0.127: U1.N5 v32.8,51.9
  Bottom 0.127: v32.8,51.9 33,51.9 33.4,51.5 33.8,51.5 34,51.7 34,52.1 34.2,52.3 35.33,52.3 38.1,49.53 45.47,49.53 47.12,51.18 48.39,51.18
S0SDQM0  (1 unrouted)
  Top 0.127: U1.N2 35.2,51.1 37.64,51.1 37.72,51.18 37.85,51.18 38.73,52.07 39.62,52.07
S0SDQM1
  Top 0.127: U1.T3 34.4,54.3 34.4,54.9 35.25,55.75 36.83,55.75 36.96,55.63 36.96,55.37 37.08,55.24 37.34,55.24 37.47,55.37 37.47,55.63 37.59,55.75 37.85,55.75 37.97,55.63 37.97,55.37 38.1,55.24 38.35,55.24 38.48,55.37 38.48,55.63 38.61,55.75 39.5,55.75 41.27,57.53 42.8,57.53 43.6,58.33 U3.B7
S0SDQS0  (via drill 0.3)  (1 unrouted)
  Top 0.127: U1.K2 35.2,48.7 37.65,48.7 37.72,48.77 37.85,48.77 39.5,50.42 44.45,50.42 44.58,50.55 v44.83,50.55
S0SDQS0_N  (via drill 0.3)  (1 unrouted)
  Top 0.127: U1.K1 37.67,49.1 37.72,49.15 37.85,49.15 39.37,50.67 44.32,50.67 44.58,50.93 45.21,50.93 v45.47,50.67
S0SDQS1  (via drill 0.3)
  Top 0.127: v44.8,55.2 U3.C3
  Top 0.152: U1.R1 35.7,53.2 v36.3,53.2
  Bottom 0.127: 44.17,55.2 v44.8,55.2
  Bottom 0.152: v36.3,53.2 36.57,53.47 39.12,53.47 41.02,55.37 44,55.37 44.17,55.2
S0SDQS1_N  (via drill 0.3)
  Top 0.127: v44.8,56 U3.D3
  Top 0.152: U1.T1 35.7,53.8 v36.3,53.8
  Bottom 0.127: 44.43,56 v44.8,56
  Bottom 0.152: v36.3,53.8 36.38,53.72 38.73,53.72 40.64,55.63 44.05,55.63 44.43,56
S0VREF  (via drill 0.3)  (5 unrouted)
  Top 0.127: U1.M4 v33.6,51.1
S0WEN  (via drill 0.3)  (2 unrouted)
  Top 0.127: U1.K3 v34.4,49.5
  Bottom 0.127: v34.4,49.5 35.34,49.5 37.08,47.75 42.93,47.75 43.05,47.62 49.28,47.62
SD0-CLK  (2 unrouted)
SD0-CMD  (2 unrouted)
SD0-D0  (2 unrouted)
SD0-D1  (2 unrouted)
SD0-D2  (2 unrouted)
SD0-D3  (3 unrouted)
SD0-DET#  (2 unrouted)
SD_VCC  (3 unrouted)
TP-INT  (1 unrouted)
TP-RST  (1 unrouted)
USB0-DRVVBUS  (2 unrouted)
USB0-IDDET  (2 unrouted)
USB-DM0  (1 unrouted)
USB-DM1  (1 unrouted)
USB-DP0  (1 unrouted)
USB-DP1  (1 unrouted)
V+  (via drill 0.3)  (74 unrouted)
  Top 0.127: U1.L5 v32.8,49.5 | U3.A2 v42.4,54.4 | U3.A9 v42.4,60 | v44.8,58.4 U3.D7 | U3.G2 v47.2,54.4 | U3.G8 v47.3,59.3 | U3.K1 v49.6,53.6 | U3.M1 v51.2,53.6 | U3.K9 v50.4,60.8 | U3.M9 v52,60.8 | U3.B9 v43.2,60.8 | U3.C1 v44,53.6 | v45.6,54.4 U3.E2 | v45.6,60.8 U3.E9
VCC  (via drill 0.3)  (36 unrouted)
  Top 0.127: U1.N6 v32,51.9
  pour PWR (isolate 0.305, rank 5): -12.7,81.28 -12.7,-12.7 -66.04,-12.7 -66.04,81.28
VCC-LCD(3V0)  (3 unrouted)
VCC-PLL  (via drill 0.3)  (3 unrouted)
  Top 0.127: U1.M5 v32.8,50.3
VCC-RTC  (3 unrouted)
VCC-RTC_AXP  (4 unrouted)
VCC/2  (21 unrouted)
VDD  (via drill 0.3)  (27 unrouted)
  Top 0.127: U1.L6 v32,49.5
VEE  (2 unrouted)
VPP  (5 unrouted)
VPS  (2 unrouted)
XTALI  (2 unrouted)
  Top 0.127: U1.U4 33.2,55.5
XTALO  (2 unrouted)
  Top 0.127: U1.T4 33.6,54.3 33.6,55.5

## Text on the board
Top: 543 errors | 6 layer PCB
GND: 351 errors
Route3: 120 errors
Route14: 223 errors
PWR: 261 errors
Bottom: 708 errors
tPlace: 2206 errors
tNames: 1 | 2 | 3 | A33-OLinuXino | Rev.A | (C) 2015 | Made in Bulgaria | Designed by: | https://www.olimex.com
bNames: A33-OLinuXino | Designed by: | UART0-TX | UART0-RX | GND | https://www.olimex.com | Made in Bulgaria | GND | 5VEXT